# EasyEDA Pro project ProPrj_火车制动系统-信阳_2025-06-22.epro

# Schematic Schematic1

## Sheets
1 P1: Board Name: Board1; Create Date: 2025-05-17; Page Name: P1; Project Name: 火车制动系统-信阳; Schematic Name: Schematic1; Update Date: 2025-05-19; Company: 嘉立创EDA; Page Size: A4; Version: V1.0
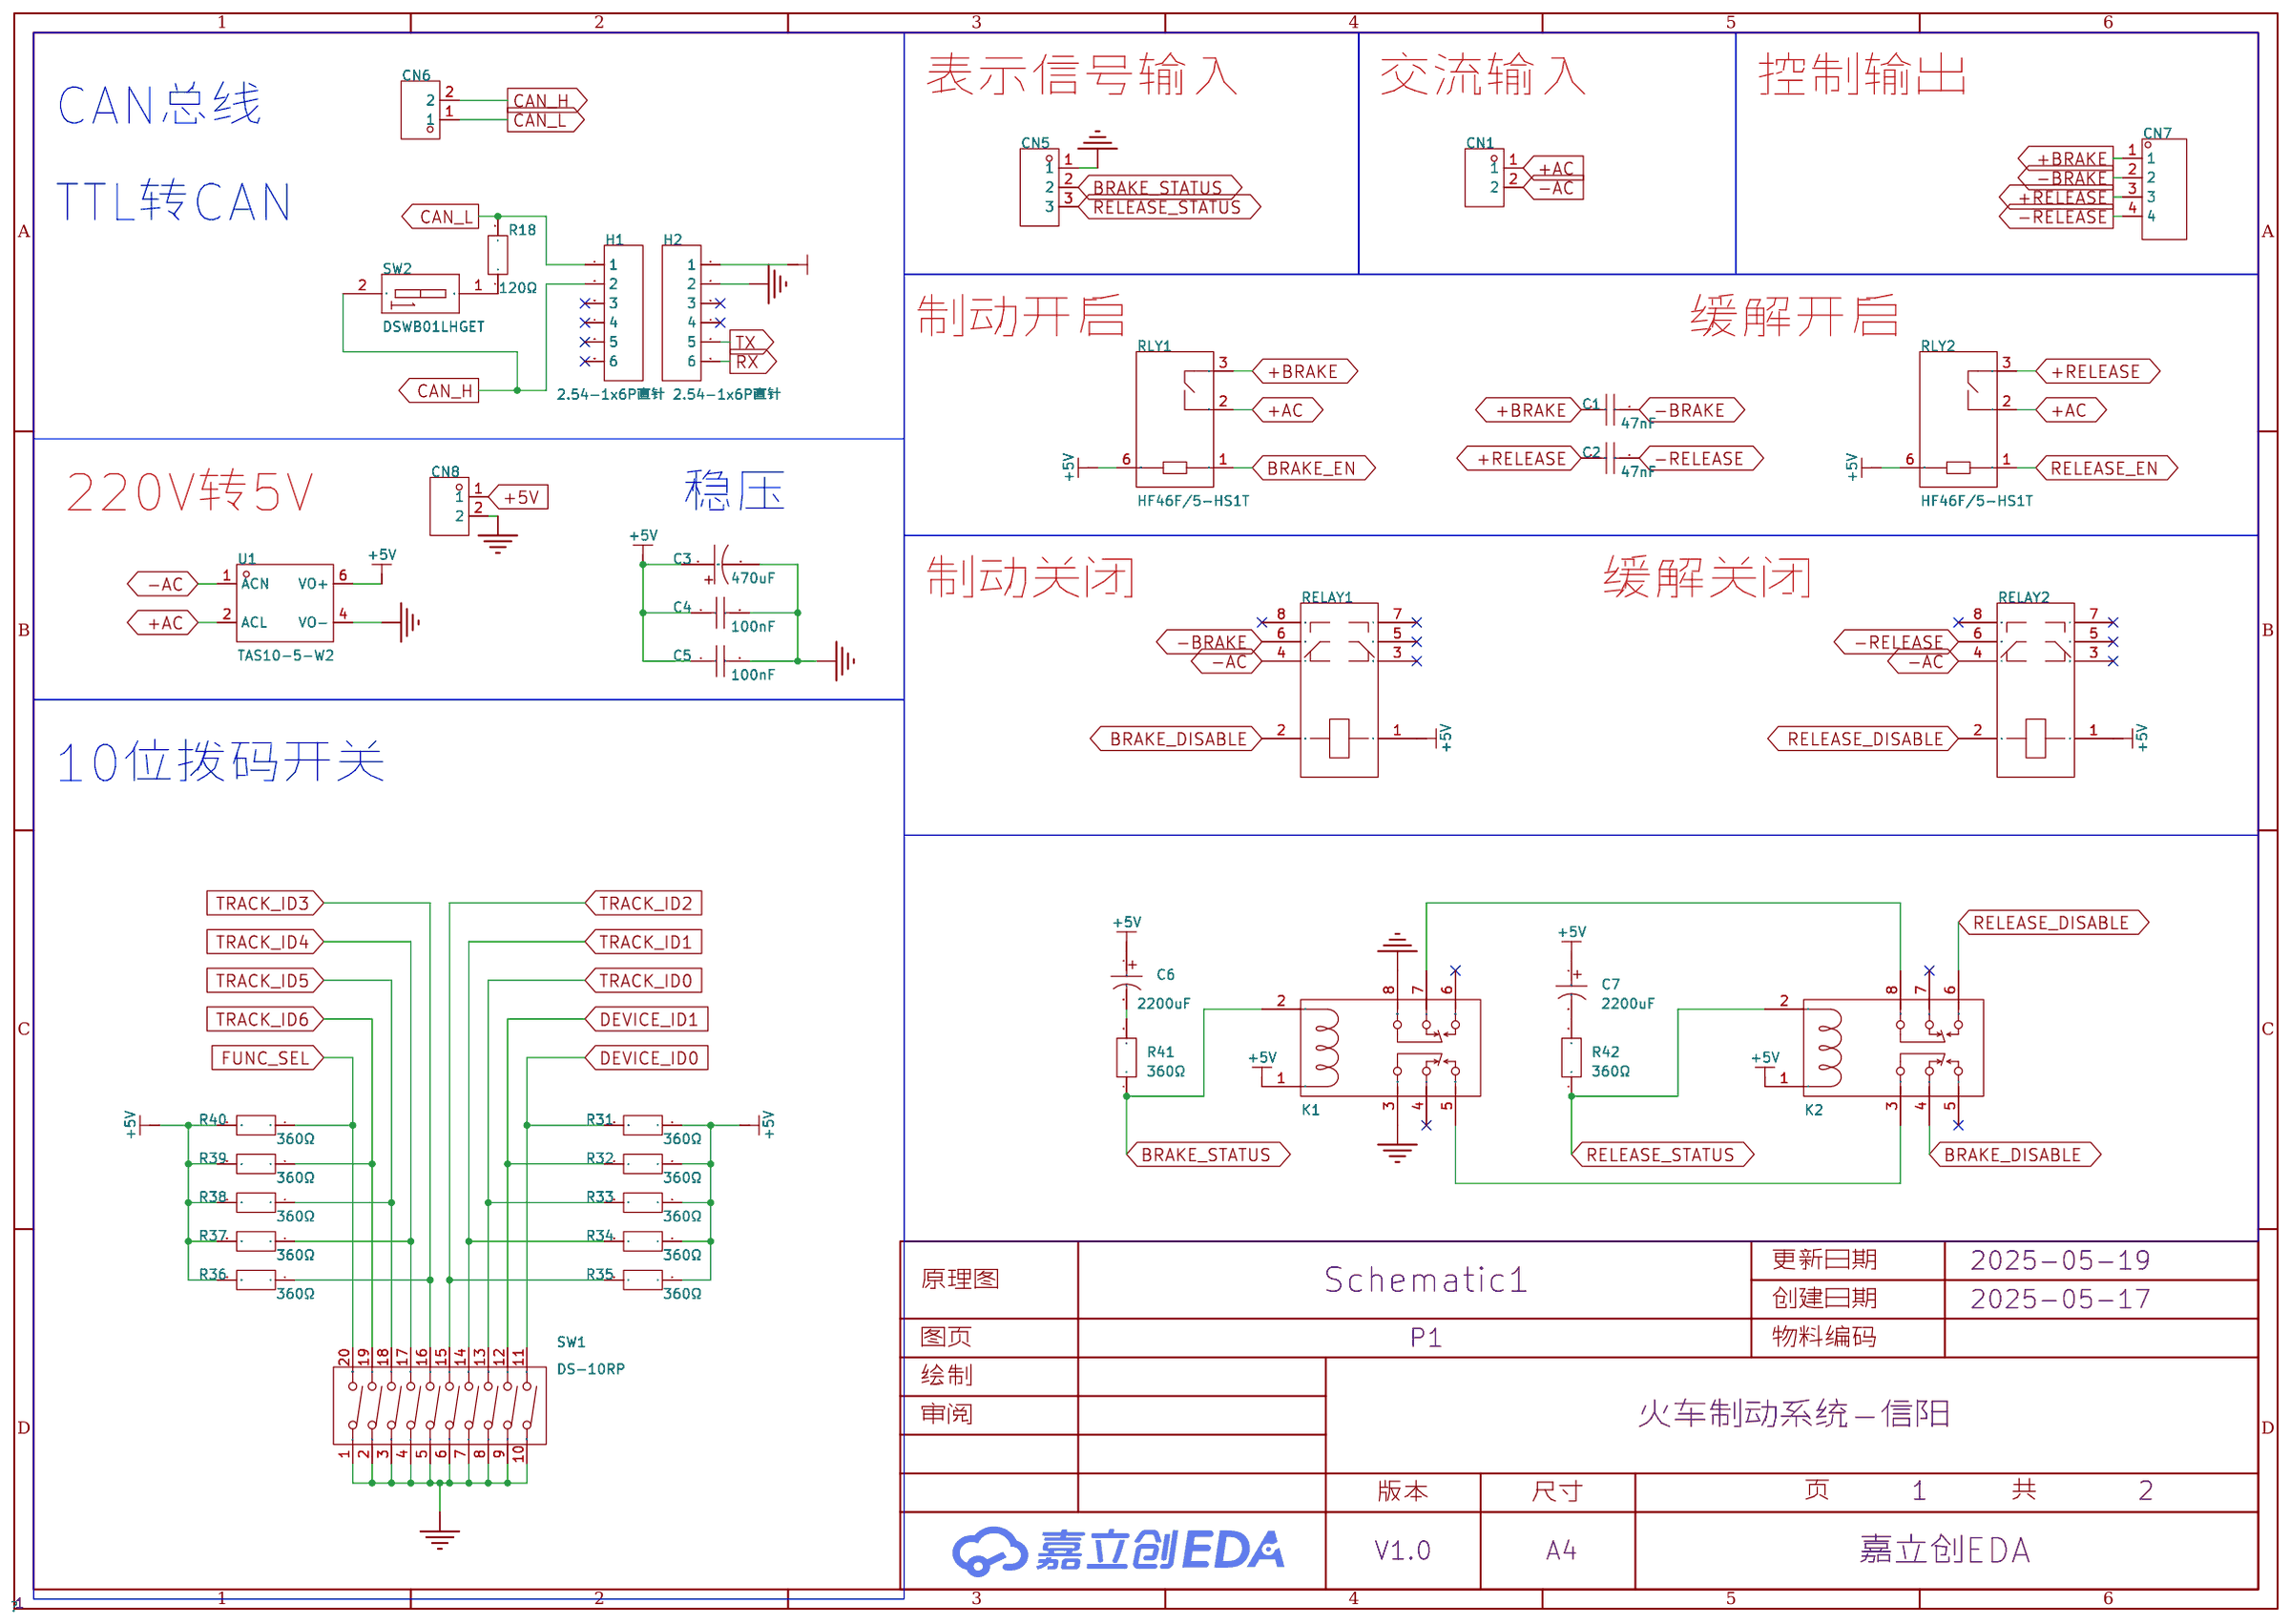
[diagram p0: P1]
2 P2: Page Name: P2; Update Date: 2025-05-27
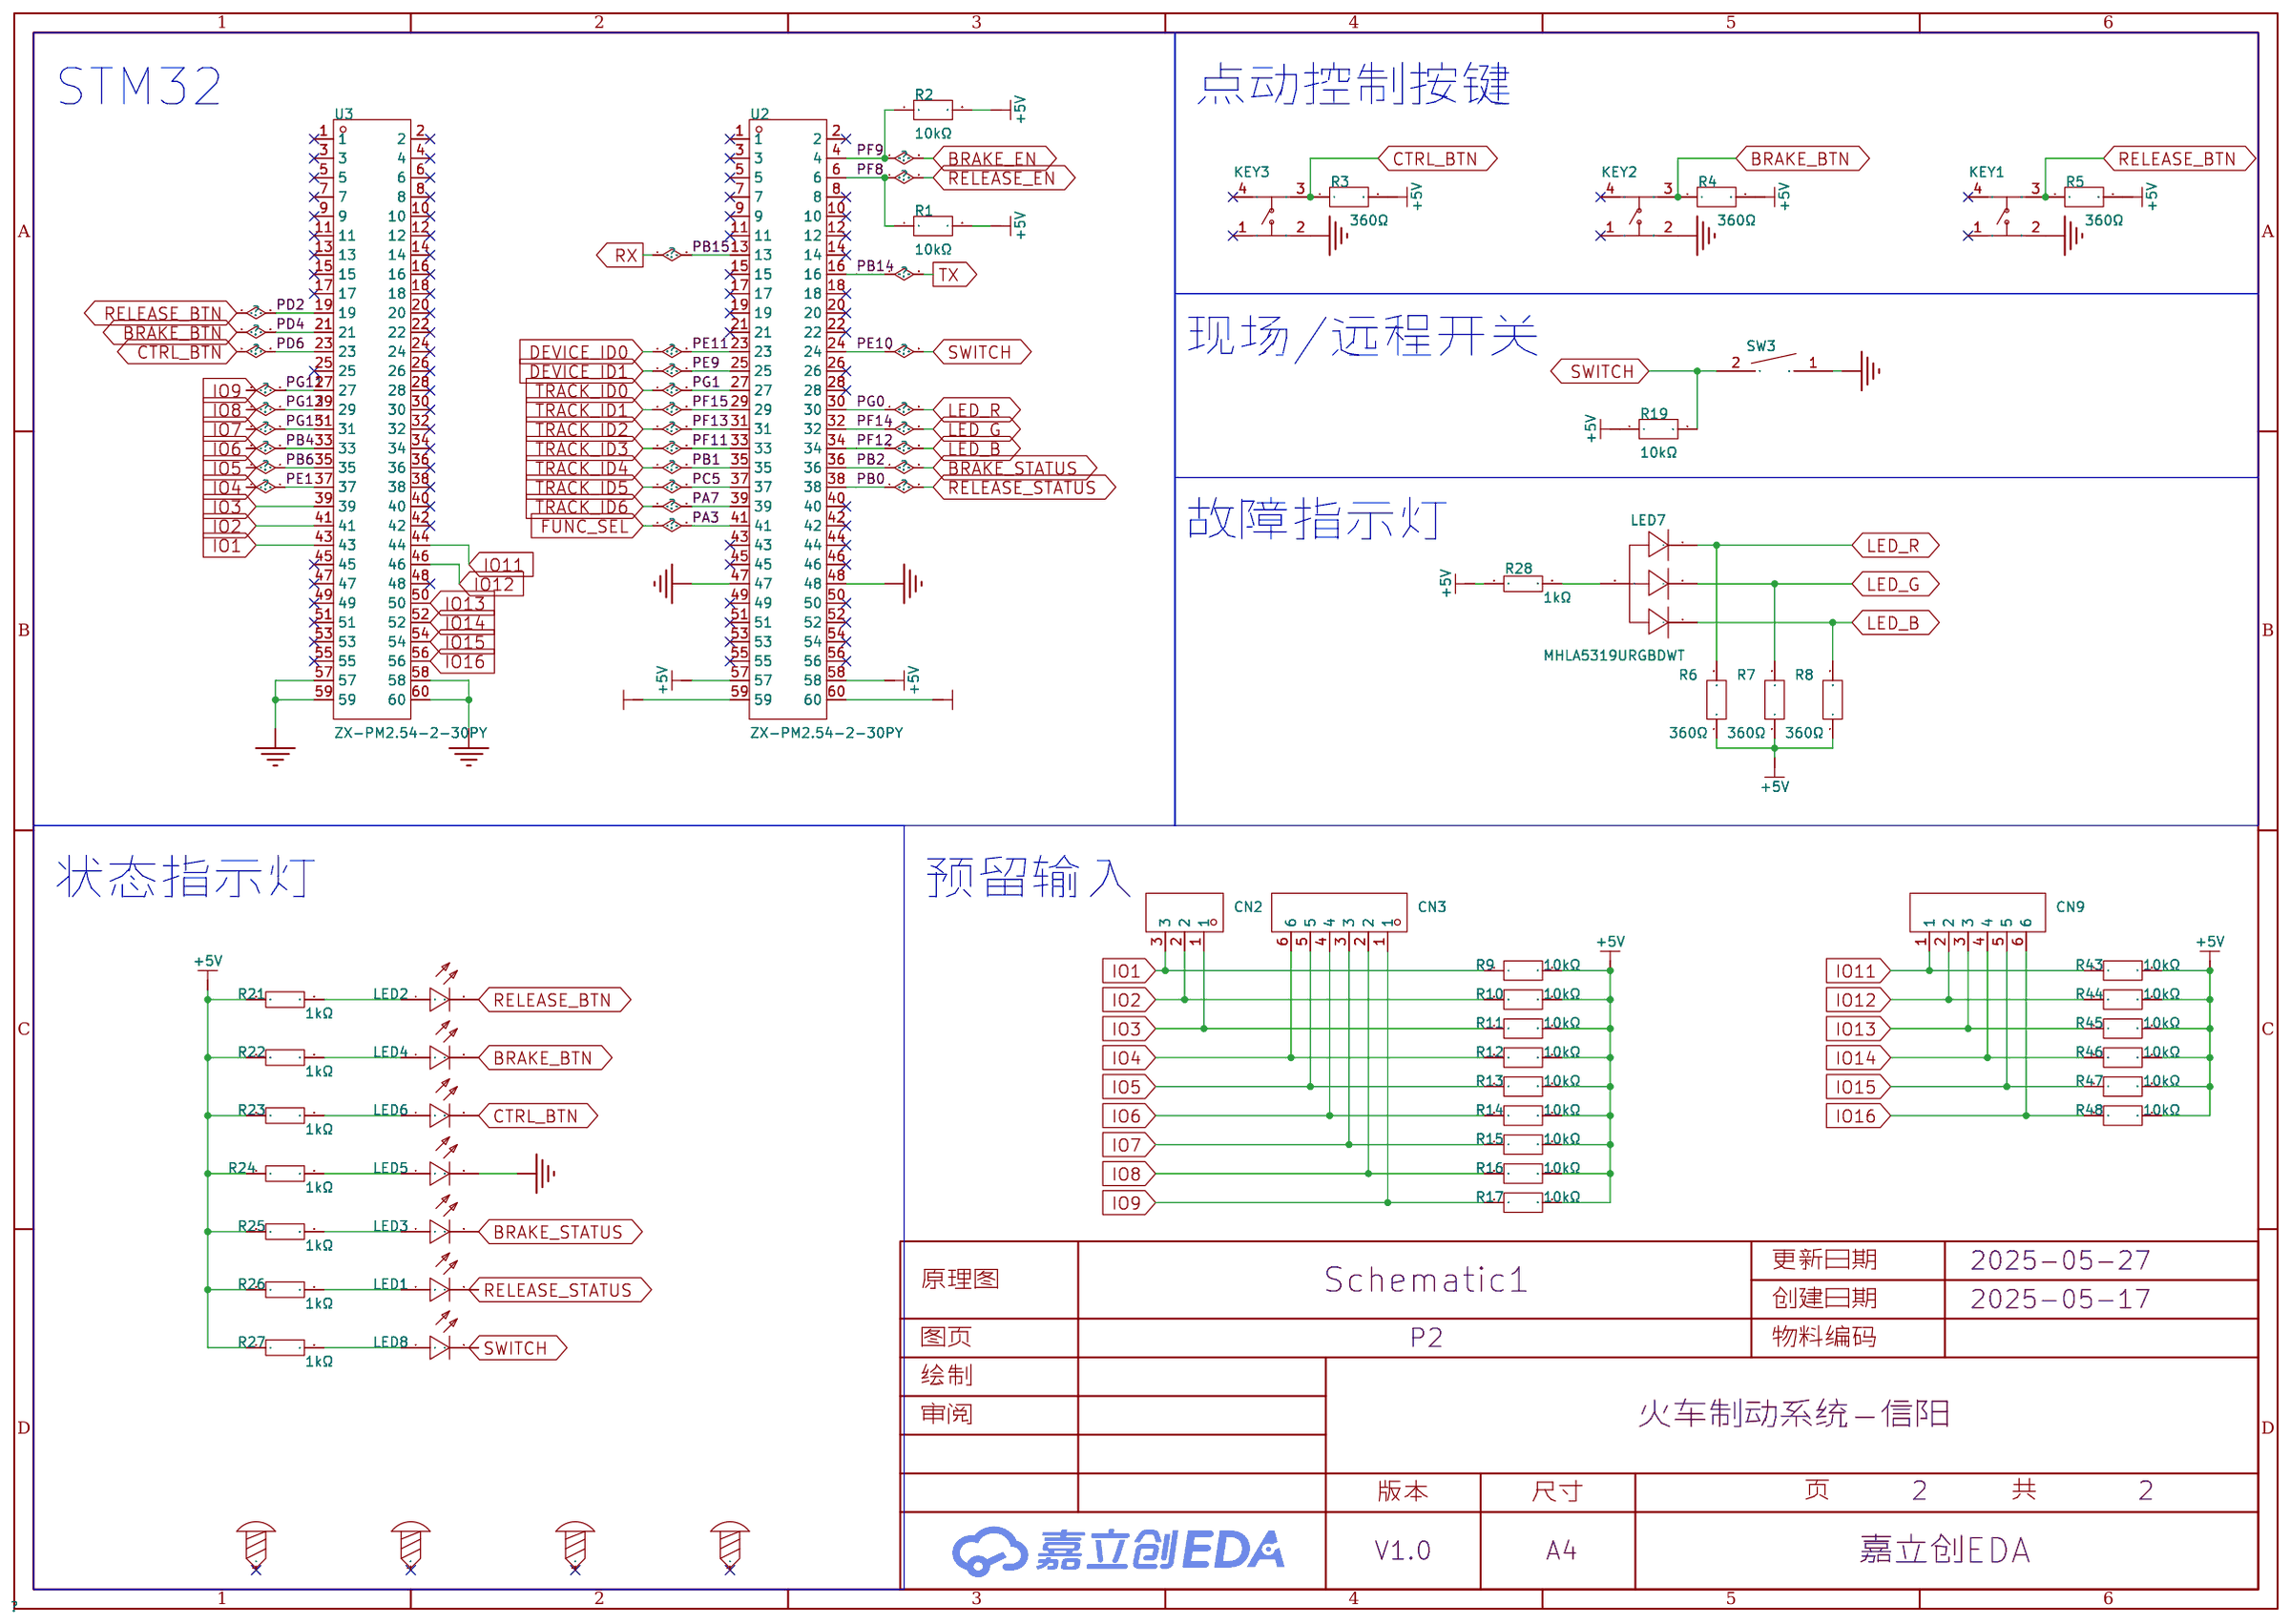
[diagram p1: P2]

## Parts
sheet P1
C1  47nF  [CAP-TH_L18.0-W5.0-P15.00-D0.8]
C2  47nF  [CAP-TH_L18.0-W5.0-P15.00-D0.8]
C3  470uF  [CAP-TH_BD8.0-P3.50-D0.6-FD]
C4  100nF  [C1210]
C5  100nF  [C1210]
C6  2200uF  [CAP-TH_BD10.0-P5.00-D1.0-FD]
C7  2200uF  [CAP-TH_BD10.0-P5.00-D1.0-FD]
CN1  KF2EDGRC-7.62-2P  [CONN-TH_P7.62_KF2EDGRC-7.62-2P]
CN5  KF2EDGRC-7.62-3P  [CONN-TH_3P-P7.62_KF2EDGRC-7.62-3P]
CN6  KF2EDGRC-7.62-2P  [CONN-TH_P7.62_KF2EDGRC-7.62-2P]
CN7  WJ15EDGVC-3.81-4P  [CONN-TH_4P-P3.81_WJ2EDGVC-3.81-4P]
CN8  WJ15EDGVC-3.81-2P  [CONN-TH_WJ15EDGVC-3.81-2P]
H1  2.54-1x6P直针  [HDR-TH_6P-P2.54-V-M-1]
H2  2.54-1x6P直针  [HDR-TH_6P-P2.54-V-M-1]
K1  HRS2H-S-DC5V-N  [RELAY-TH_HRS2H-S-XX]
K2  HRS2H-S-DC5V-N  [RELAY-TH_HRS2H-S-XX]
R18  120Ω  [R1210]
R31  360Ω  [R1210]
R32  360Ω  [R1210]
R33  360Ω  [R1210]
R34  360Ω  [R1210]
R35  360Ω  [R1210]
R36  360Ω  [R1210]
R37  360Ω  [R1210]
R38  360Ω  [R1210]
R39  360Ω  [R1210]
R40  360Ω  [R1210]
R41  360Ω  [R1210]
R42  360Ω  [R1210]
RELAY1  HF115F/005-2ZS4  [RELAY-TH_HF115F-024-2ZS4]
RELAY2  HF115F/005-2ZS4  [RELAY-TH_HF115F-024-2ZS4]
RLY1  HF46F/5-HS1T  [RELAYS-TH_HF46F-XX-HS1-XXX]
RLY2  HF46F/5-HS1T  [RELAYS-TH_HF46F-XX-HS1-XXX]
SW1  DS-10RP  [SW-TH_DS-10RP]
SW2  DSWB01LHGET  [SW-TH_DSWB01LHGET]
U1  TAS10-5-W2  [PWRM-TH_TAS10-XX-W2]
sheet P2
CN2  KF2EDGRC-7.62-3P  [CONN-TH_3P-P7.62_KF2EDGRC-7.62-3P]
CN3  KF2EDGRC-7.62-6P  [CONN-TH_6P-P7.62_KF2EDGRC-7.62-6P]
CN9  DB2EVC-3.81-6P-GN  [CONN-TH_6P-P3.81_DB2EVC-3.81-6P]
KEY1  B3F-4055  [KEY-TH_4P-L12.0-W12.0-P5.00-LS13.4-EH]
KEY2  B3F-4055  [KEY-TH_4P-L12.0-W12.0-P5.00-LS13.4-EH]
KEY3  B3F-4055  [KEY-TH_4P-L12.0-W12.0-P5.00-LS13.4-EH]
LED1  204-10SURD/S530-A3  [LED-TH_BD3.0-P2.54-FD]
LED2  204-10SURD/S530-A3  [LED-TH_BD3.0-P2.54-FD]
LED3  204-10SURD/S530-A3  [LED-TH_BD3.0-P2.54-FD]
LED4  204-10SURD/S530-A3  [LED-TH_BD3.0-P2.54-FD]
LED5  204-10SURD/S530-A3  [LED-TH_BD3.0-P2.54-FD]
LED6  204-10SURD/S530-A3  [LED-TH_BD3.0-P2.54-FD]
LED7  MHLA5319URGBDWT  [LED-TH_4P-BD6.9-P1.27-R]
LED8  204-10SURD/S530-A3  [LED-TH_BD3.0-P2.54-FD]
R1  10kΩ  [R1210]
R2  10kΩ  [R1210]
R3  360Ω  [R1210]
R4  360Ω  [R1210]
R5  360Ω  [R1210]
R6  360Ω  [R1210]
R7  360Ω  [R1210]
R8  360Ω  [R1210]
R9  10kΩ  [R1210]
R10  10kΩ  [R1210]
R11  10kΩ  [R1210]
R12  10kΩ  [R1210]
R13  10kΩ  [R1210]
R14  10kΩ  [R1210]
R15  10kΩ  [R1210]
R16  10kΩ  [R1210]
R17  10kΩ  [R1210]
R19  10kΩ  [R1210]
R21  1kΩ  [R1210]
R22  1kΩ  [R1210]
R23  1kΩ  [R1210]
R24  1kΩ  [R1210]
R25  1kΩ  [R1210]
R26  1kΩ  [R1210]
R27  1kΩ  [R1210]
R28  1kΩ  [R1210]
R43  10kΩ  [R1210]
R44  10kΩ  [R1210]
R45  10kΩ  [R1210]
R46  10kΩ  [R1210]
R47  10kΩ  [R1210]
R48  10kΩ  [R1210]
SCREW1  -  [M4螺丝]
SCREW2  -  [M4螺丝]
SCREW3  -  [M4螺丝]
SCREW4  -  [M4螺丝]
SW3  RS601HL-1010011BB  [SW-TH_RS601HL-1010011BB]
U2  ZX-PM2.54-2-30PY  [HDR-TH_60P-P2.54-V-F-R2-C30-S2.54]
U3  ZX-PM2.54-2-30PY  [HDR-TH_60P-P2.54-V-F-R2-C30-S2.54]

## Library data of the parts
C1 C2 = MEX473K275A01: 容值:47nF;精度:±10%;电压(AC):275V;等级:X2;; LCSC Part Name: 等级:X2 47nF ±10% 275V; Supplier Part: C8970; Manufacturer: TENTA(天泰); Supplier Footprint: 插件,P=15mm; JLCPCB Part Class: 扩展库; Datasheet: https://atta.szlcsc.com/upload/public/pdf/source/20180207/C180193_15179897177401356415.pdf; Supplier: LCSC; Tolerance: ±10%; Voltage(AC): 275V; Subclass: X2
C3 = ERS1CM471F12OT: 容值:470uF;精度:±20%;额定电压:16V;; LCSC Part Name: 470uF ±20% 16V; Supplier Part: C160146; Manufacturer: AISHI(艾华集团); Supplier Footprint: 插件,D8xL12mm; JLCPCB Part Class: 扩展库; Datasheet: https://atta.szlcsc.com/upload/public/pdf/source/20191015/C438940_4B8E60A742BB0AE40DDEF87A5C89089D.pdf; Supplier: LCSC; Tolerance: ±20%; Rated Voltage: 16V; Lead Spacing: 3.5mm; φD: 8mm; L: 12mm; Lifetime @ Temp: 7000hrs@105℃
C4 C5 = 1210B104K500NT: 容值:100nF;精度:±10%;额定电压:50V;材质(温度系数):X7R;; LCSC Part Name: 100nF ±10% 50V; Supplier Part: C76567; Manufacturer: FH(风华); Supplier Footprint: 1210; JLCPCB Part Class: 扩展库; Datasheet: https://atta.szlcsc.com/upload/public/pdf/source/20200305/C486355_26A10D38EF8C2A5C37091D0039909270.pdf; Supplier: LCSC; Tolerance: ±10%; Voltage Rated: 50V; Temperature Coefficient: X7R
C6 C7 = KF222M016G200A: 容值:2200uF;精度:±20%;额定电压:16V;; LCSC Part Name: 2200uF ±20% 16V; Supplier Part: C77730; Manufacturer: CapXon(丰宾); Supplier Footprint: 插件,D10xL20mm; JLCPCB Part Class: 扩展库; Datasheet: https://atta.szlcsc.com/upload/public/pdf/source/20190311/C77730_4071F7D6331134CE149FE96A0814C9E0.pdf; Supplier: LCSC; Tolerance: ±20%; Rated Voltage: 16V; Lead Spacing: 5mm; φD: 10mm; L: 20mm; Lifetime @ Temp: 5000hrs@105℃
CN1 CN6 = KF2EDGRC-7.62-2P: 连接器类型:板端/插座-闭口;结构:1x2P;间距:7.62mm;颜色:绿色;安装方式:弯针;排数:1;每排PIN数:2;额定电流:15A;额定电压:400V;工作温度范围:-40℃~+105℃;; LCSC Part Name: 7.62mm 1x2P 排数:1 每排P数:2; Supplier Part: C441246; Manufacturer: KEFA(科发); Supplier Footprint: 弯插,P=7.62mm; JLCPCB Part Class: 扩展库; Datasheet: https://atta.szlcsc.com/upload/public/pdf/source/20230331/98017C42E55659E793A45F1EF0D85FE6.pdf; Supplier: LCSC; Connector Type: 板端/插座-闭口; Structure: 1x2P; Pitch: 7.62mm; Color: 绿色; Mounting Style: 弯针; Number of Rows: 1; Number of PINs Per Row: 2; Current Rating (Max): 15A; Voltage Rating (Max): 400V; Operating Temperature Range: -40℃~+105℃
CN2 CN5 = KF2EDGRC-7.62-3P: 连接器类型:板端/插座-闭口;结构:1x3P;间距:7.62mm;颜色:绿色;安装方式:弯针;排数:1;每排PIN数:3;额定电流:15A;额定电压:400V;工作温度范围:-40℃~+105℃;; LCSC Part Name: 7.62mm 1x3P 排数:1 每排P数:3; Supplier Part: C441247; Manufacturer: KEFA(科发); Supplier Footprint: 弯插,P=7.62mm; JLCPCB Part Class: Extended Part; Datasheet: https://atta.szlcsc.com/upload/public/pdf/source/20230331/98017C42E55659E793A45F1EF0D85FE6.pdf; Supplier: LCSC; Connector Type: 板端/插座-闭口; Structure: 1x3P; Pitch: 7.62mm; Color: 绿色; Mounting Style: 弯针; Number of Pins: 3P; Number of Rows: 1; Number of PINs Per Row: 3; Current Rating (Max): 15A; Voltage Rating (Max): 400V; Operating Temperature Range: -40℃~+105℃
CN7 = WJ15EDGVC-3.81-4P: 连接器类型:板端/插座-闭口;固定方式:-;结构:1x4P;间距:3.81mm;颜色:-;安装方式:直针;排数:1;每排PIN数:4;额定电流:8A;额定电压:300V;线规 - AWG:-;线规 - 平方毫米:-;触头材质:黄铜;触头镀层:锡;工作温度范围:-40℃~+105℃;焊接温度(最大值):-;; LCSC Part Name: 1x4P 3.81mm 排数:1 每排P数:4; Supplier Part: C8410; Manufacturer: KANGNEX(康奈克斯电气); Supplier Footprint: 插件,P=3.81mm; JLCPCB Part Class: 扩展库; Datasheet: https://atta.szlcsc.com/upload/public/pdf/source/20191225/C8410_C8794F457058DA07325589F32B6A11CC.pdf; Supplier: LCSC; Connector Type: 板端/插座-闭口; Structure: 1x4P; Pitch: 3.81mm; Mounting Style: 直针; Number of Pins: 4P; Number of Rows: 1; Number of PINs Per Row: 4; Current Rating (Max): 8A; Voltage Rating (Max): 300V; Contact Material: 黄铜; Contact Plating: 锡; Operating Temperature Range: -40℃~+105℃
CN8 = WJ15EDGVC-3.81-2P: 连接器类型:板端/插座-闭口;固定方式:-;结构:1x2P;间距:3.81mm;颜色:-;安装方式:直针;排数:1;每排PIN数:2;额定电流:8A;额定电压:300V;线规 - AWG:-;线规 - 平方毫米:-;触头材质:黄铜;触头镀层:锡;工作温度范围:-40℃~+105℃;焊接温度(最大值):-;; LCSC Part Name: 1x2P 3.81mm 排数:1 每排P数:2; Supplier Part: C8396; Manufacturer: KANGNEX(康奈克斯电气); Supplier Footprint: 插件,P=3.81mm; JLCPCB Part Class: Extended Part; Datasheet: https://atta.szlcsc.com/upload/public/pdf/source/20191225/C8396_DFFE6D58C2AF45781C2AF0BF2B733CCC.pdf; Supplier: LCSC; Connector Type: 板端/插座-闭口; Structure: 1x2P; Pitch: 3.81mm; Mounting Style: 直针; Number of Pins: 2P; Number of Rows: 1; Number of PINs Per Row: 2; Current Rating (Max): 8A; Voltage Rating (Max): 300V; Contact Material: 黄铜; Contact Plating: 锡; Operating Temperature Range: -40℃~+105℃
H1 H2 = 2.54-1x6P直针: 插针结构:1x6P;间距:2.54mm;行距:-;圆针/方针:方针;安装方式:直插;排数:单排;总PIN位数:6P;额定电流:3A;额定电压:-;配合针长度:-;塑高:-;触头材质:黄铜;触头镀层:-;工作温度:-40℃~+105℃;颜色:黑色;; LCSC Part Name: 1x6P 间距:2.54mm 方针 直插; Supplier Part: C37208; Manufacturer: BOOMELE(博穆精密); Supplier Footprint: 插件,P=2.54mm; JLCPCB Part Class: Extended Part; Datasheet: https://atta.szlcsc.com/upload/public/pdf/source/20250115/42A019761A40C8B839643401D8CA5A96.pdf; Supplier: LCSC; Pin Structure: 1x6P; Pitch: 2.54mm; Circluar Pins/Square Pins: 方针; Mounting Type: 直插; Number of Rows: 单排; Number of Pins: 6P; Current Rating: 3A; Contact Material: 黄铜; Operating Temperature: -40℃~+105℃; Color: 黑色
K1 K2 = HRS2H-S-DC5V-N: 线圈电压:-;触点形式:-;触点容量(电阻负载):-;最大切换电压:-;最大切换电流:-;; Supplier Part: C13497; Manufacturer: HKE(汇港); Supplier Footprint: DIP,9.9x21mm; JLCPCB Part Class: Extended Part; Datasheet: https://atta.szlcsc.com/upload/public/pdf/source/20161108/1478586357401.pdf; Supplier: LCSC
R18 = FRC1210J121 TS: 电阻类型:厚膜电阻;阻值:120Ω;精度:±5%;功率:500mW;最大工作电压:200V;温度系数:±100ppm/℃;; LCSC Part Name: 厚膜电阻 120Ω ±5% 500mW; Supplier Part: C2933833; Manufacturer: FOJAN(富捷); Supplier Footprint: 1210; JLCPCB Part Class: 扩展库; Datasheet: https://atta.szlcsc.com/upload/public/pdf/source/20211221/925EC7D7225764EE0046F22065062C87.pdf; Supplier: LCSC; Type: 厚膜电阻; Tolerance: ±5%; Power(Watts): 500mW; Overload Voltage (Max): 200V; Temperature Coefficient: ±100ppm/℃; Operating Temperature Range: -55℃~+155℃
R3-R8 R31-R42 = AC1210JR-07360RL: 电阻类型:厚膜电阻;阻值:360Ω;精度:±5%;功率:500mW;最大工作电压:200V;温度系数:±100ppm/℃;; LCSC Part Name: 厚膜电阻 360Ω ±5% 500mW; Supplier Part: C230448; Manufacturer: YAGEO(国巨); Supplier Footprint: 1210; JLCPCB Part Class: 扩展库; Datasheet: https://atta.szlcsc.com/upload/public/pdf/source/20191108/C230504_7FB43CAE7E86B3B2980C2491161B254C.pdf; Supplier: LCSC; Type: 厚膜电阻; Tolerance: ±5%; Power(Watts): 500mW; Overload Voltage (Max): 200V; Temperature Coefficient: ±100ppm/℃; Operating Temperature Range: -55℃~+155℃
RELAY1 RELAY2 = HF115F/005-2ZS4: 线圈电压:5V;触点形式:两组转换:2C(双刀双掷-转换);触点容量(电阻负载):8A@250VAC;最大切换电压:440V@AC；300V@DC;最大切换电流:8A;; Supplier Part: C9226; Manufacturer: HF(宏发); Supplier Footprint: DIP,12.7x29mm; JLCPCB Part Class: 扩展库; Datasheet: https://atta.szlcsc.com/upload/public/pdf/source/20180326/C9226_00E5F9D0110139C053E72FC6A3214472.pdf; Supplier: LCSC; Coil Voltage: 5V; Contact Form: 两组转换:2C(双刀双掷-转换); Pin Number: 8; Contact Rating: 8A@250VAC; Maximum Switching Voltage: 440V@AC；300V@DC; Coil Rated Power: 400mW; Contact Material: AgCdO; Maximum Switching Current: 8A; Coil Type: 无极性-单线圈; Coil Resistance: 62Ω; Contact Resistance: 100mΩ; Operate Time: 15ms; Release Time: 8ms; Operating Temperature: -40℃~+85℃
RLY1 RLY2 = HF46F/5-HS1T_C3036134: 线圈电压:5V;触点形式:一组常开:1A(单刀单掷-常开);触点容量(电阻负载):5A@30VDC；5A@250VAC;最大切换电压:277V@AC；30V@DC;最大切换电流:5A;; LCSC Part Name: 超小型中功率5V继电器 单刀单掷-常开; Supplier Part: C3036134; Manufacturer: HF(宏发); Supplier Footprint: 插件,7x20.5mm; JLCPCB Part Class: Extended Part; Datasheet: https://atta.szlcsc.com/upload/public/pdf/source/20180301/C182930_15198945723621384141.pdf; Supplier: LCSC; Coil Voltage: 5V; Contact Form: 一组常开:1A(单刀单掷-常开); Pin Number: 4; Contact Rating: 5A@30VDC；5A@250VAC; Maximum Switching Voltage: 277V@AC；30V@DC; Coil Rated Power: 200mW; Contact Material: AgSnO2; Maximum Switching Current: 5A; Coil Type: 无极性-单线圈; Coil Resistance: 125Ω; Contact Resistance: 100mΩ; Operate Time: 10ms; Release Time: 10ms; Operating Temperature: -40℃~+85℃
SW1 = DS-10RP: 类型:平拨,凸起式;电路结构:单刀单掷;开关位数:10位;额定电流:25mA;额定电压:24V;使用寿命:3千次;颜色:红色;; LCSC Part Name: 间距2.54mm 平拨,凸起式 10位拨码开关; Supplier Part: C458082; Manufacturer: 韩国韩荣; Supplier Footprint: 插件; JLCPCB Part Class: 扩展库; Datasheet: https://atta.szlcsc.com/upload/public/pdf/source/20210810/ECF2F28B1CE673E7F9581E27682BDB10.pdf; Supplier: LCSC; Type: 平拨,凸起式; Circuit: 单刀单掷; Number of Positions: 10位; Lead Pitch: 2.54mm; Current Rating: 25mA; Voltage Rating: 24V; Operating Temperature: -20℃~+70℃; Operating Life: 3千次; Color: 红色
SW2 = DSWB01LHGET: 类型:平拨,凸起式;电路结构:单刀单掷;开关位数:1位;使用寿命:-;颜色:红色;; LCSC Part Name: 红色宽体1位顶拨插件; Supplier Part: C126888; Manufacturer: YE; Supplier Footprint: 插件,9.9x4mm; JLCPCB Part Class: 扩展库; Datasheet: https://atta.szlcsc.com/upload/public/pdf/source/20240423/2AB41BE17D24959C6789B2A71E54D492.pdf; Supplier: LCSC; Type: 平拨,凸起式; Circuit: 单刀单掷; Number of Positions: 1位; Color: 红色
U1 = TAS10-5-W2: 输出5V,峰值10W,精度1%,耐压大于2.5KVAC,工业级,该系列效率高达85%,待机功耗低至0.15W,输出纹波外加铝电容小于50mV，标准尺寸多厂家管脚兼容，DIP:38*19*18; Supplier Part: C2687655; Manufacturer: TDPOWER(腾达电源); Supplier Footprint: 插件,25x39mm; JLCPCB Part Class: Extended Part; Datasheet: https://atta.szlcsc.com/upload/public/pdf/source/20210914/95F169B7B21081D929A6CFE8A15609A6.pdf; Supplier: LCSC
CN3 = KF2EDGRC-7.62-6P: 连接器类型:板端/插座-闭口;结构:1x6P;间距:7.62mm;颜色:绿色;安装方式:弯针;排数:1;每排PIN数:6;额定电流:15A;额定电压:400V;工作温度范围:-40℃~+105℃;; LCSC Part Name: 7.62mm 1x6P 排数:1 每排P数:6; Supplier Part: C441250; Manufacturer: KEFA(科发); Supplier Footprint: 弯插,P=7.62mm; JLCPCB Part Class: 扩展库; Datasheet: https://atta.szlcsc.com/upload/public/pdf/source/20230331/98017C42E55659E793A45F1EF0D85FE6.pdf; Supplier: LCSC; Connector Type: 板端/插座-闭口; Structure: 1x6P; Pitch: 7.62mm; Color: 绿色; Mounting Style: 弯针; Number of Pins: 6P; Number of Rows: 1; Number of PINs Per Row: 6; Current Rating (Max): 15A; Voltage Rating (Max): 400V; Operating Temperature Range: -40℃~+105℃
CN9 = DB2EVC-3.81-6P-GN: 连接器类型:板端/插座-闭口;结构:1x6P;间距:3.81mm;颜色:绿色;安装方式:直针;排数:1;每排PIN数:6;额定电流:10A;额定电压:250V;工作温度范围:-40℃~+105℃;; LCSC Part Name: 3.81mm 1x6P 排数:1 每排P数:6; Supplier Part: C395707; Manufacturer: DORABO(地博电气); Supplier Footprint: 插件,P=3.81mm; JLCPCB Part Class: 扩展库; Datasheet: https://atta.szlcsc.com/upload/public/pdf/source/20230106/E295F87ABDAA44E449E4D4A582259339.pdf; Supplier: LCSC; Connector Type: 板端/插座-闭口; Structure: 1x6P; Pitch: 3.81mm; Color: 绿色; Mounting Style: 直针; Number of Pins: 6P; Number of Rows: 1; Number of PINs Per Row: 6; Current Rating (Max): 10A; Voltage Rating (Max): 250V; Operating Temperature Range: -40℃~+105℃
KEY1-KEY3 = B3F-4055_C84931: 电路结构:单刀单掷;按钮形状:矩形按钮;安装方式:直插;开关长度:12mm;开关宽度:12mm;开关高度:7.3mm;触点电流:50mA;额定电压(DC):24V;带灯:-;机械寿命:-;; LCSC Part Name: 12*12*7.3mm 直插 轻触开关; Supplier Part: C84931; Manufacturer: OMRON(欧姆龙); Supplier Footprint: 插件; JLCPCB Part Class: 扩展库; Datasheet: https://atta.szlcsc.com/upload/public/pdf/source/20170810/C93157_1502335414592880008.pdf; Supplier: LCSC; Circuit: 单刀单掷; Actuator Style: 矩形按钮; Mounting Style: 直插; Switch Length: 12mm; Switch Width: 12mm; Switch Height: 7.3mm; Contact Current: 50mA; Voltage Rating (DC): 24V
LED1-LED6 LED8 = 204-10SURD/S530-A3: 灯头类型:3mm圆形灯头;发光颜色:红色;正向电压(VF):2V;功率:60mW;正向电流:20mA;主波长:624nm;二极管配置:-;透镜颜色:雾状红透镜;色温:-;发光强度:80mcd;发光角度:45°;载带方式:-;工作温度:-40℃~+85℃;; Supplier Part: C99772; Manufacturer: EVERLIGHT(亿光); Supplier Footprint: 插件,D=3mm; JLCPCB Part Class: Extended Part; Datasheet: https://atta.szlcsc.com/upload/public/pdf/source/20170504/1493866937400.pdf; Supplier: LCSC; Lamp Holder Type: 3mm圆形灯头; Emitted Color: 红色; Forward Voltage (VF): 2V; Power Dissipation: 60mW; Forward Current: 20mA; Dominant Wavelength: 624nm; Peak Wavelength: 632nm; Lens Color: 雾状红透镜; Luminous Intensity: 80mcd; Viewing Angle: 45°; Operating Temperature: -40℃~+85℃
LED7 = MHLA5319URGBDWT: LCSC Part Name: RGB三色; Supplier Part: C417349; Manufacturer: MEIHUA(美华); Supplier Footprint: 插件,D=5mm; JLCPCB Part Class: 扩展库; Datasheet: https://atta.szlcsc.com/upload/public/pdf/source/20190909/C417349_5EE64C2B845439F4B2C4E6D0A2E388FC.pdf; Supplier: LCSC
R1 R2 R9-R17 R19 R43-R48 = 1210W2J0103T5E: 电阻类型:厚膜电阻;阻值:10kΩ;精度:±5%;功率:500mW;最大工作电压:200V;温度系数:±100ppm/℃;; LCSC Part Name: 10kΩ ±5% 500mW 厚膜电阻; Supplier Part: C474295; Manufacturer: UNI-ROYAL(厚声); Supplier Footprint: 1210; JLCPCB Part Class: 扩展库; Datasheet: https://atta.szlcsc.com/upload/public/pdf/source/20200306/C422600_1E6D84923E4A46A82E41ADD87F860B5C.pdf; Supplier: LCSC; Type: 厚膜电阻; Tolerance: ±5%; Power(Watts): 500mW; Overload Voltage (Max): 200V; Temperature Coefficient: ±100ppm/℃; Operating Temperature Range: -55℃~+155℃
R21-R28 = 1210W2J0102T5E: 电阻类型:厚膜电阻;阻值:1kΩ;精度:±5%;功率:500mW;最大工作电压:200V;温度系数:±100ppm/℃;; LCSC Part Name: 1kΩ ±5% 500mW 厚膜电阻; Supplier Part: C270888; Manufacturer: UNI-ROYAL(厚声); Supplier Footprint: 1210; JLCPCB Part Class: 扩展库; Datasheet: https://atta.szlcsc.com/upload/public/pdf/source/20200306/C422600_1E6D84923E4A46A82E41ADD87F860B5C.pdf; Supplier: LCSC; Type: 厚膜电阻; Tolerance: ±5%; Power(Watts): 500mW; Overload Voltage (Max): 200V; Temperature Coefficient: ±100ppm/℃; Operating Temperature Range: -55℃~+155℃
SCREW1-SCREW4 = M4螺丝: Supplier Footprint: 插件
SW3 = RS601HL-1010011BB: 带灯:无;引脚样式:焊片;额定电流:3A;额定电压(AC):250V;额定电压(DC):-;电路结构:单刀单掷;机械寿命:1万次;; Supplier Part: C2885782; Manufacturer: HCTL(华灿天禄); Supplier Footprint: 插件; JLCPCB Part Class: 扩展库; Datasheet: https://atta.szlcsc.com/upload/public/pdf/source/20210820/B1970E40D09304D7FA648AE2099FB3E8.pdf; Supplier: LCSC; Switch Length: 15mm; Switch Width: 10.5mm; Switch Height: 11.7mm; Actuator Type: 凹面弯曲; With Lamp: 无; Pin Style: 焊片; Actuator Color: 黑色; Contact Current: 3A; Voltage Rating (AC): 250V; Circuit: 单刀单掷; Mechanical Life: 1万次; Operating Temperature: -25℃~+85℃; Actuator Identifier: - O
U2 = ZX-PM2.54-2-30PY: 插孔结构:2x30P;间距:2.54mm;行距:2.54mm;圆孔/方孔:方孔;安装类型:直插;排数:双排;总孔位数:60P;额定电流:-;额定电压:1kV;插孔方向:顶部;塑高:8.5mm;触头材质:-;触头镀层:金;工作温度范围:-40℃~+105℃;焊接温度(最大值):260℃@5S;; LCSC Part Name: 2x30P 间距:2.54mm 直插; Supplier Part: C7499356; Manufacturer: Megastar(兆星); Supplier Footprint: 插件,P=2.54mm; JLCPCB Part Class: 扩展库; Datasheet: https://atta.szlcsc.com/upload/public/pdf/source/20231122/23E1107B34356833C267F6B6E856DE02.pdf; Supplier: LCSC; Holes Structure: 2x30P; Pitch: 2.54mm; Row Spacing: 2.54mm; Circular Hole / Square Hole: 方孔; Mounting Type: 直插; Number of Rows: 双排; Number of Holes: 60P; Voltage Rating (Max): 1kV; Holes Direction: 顶部; Insulation Height: 8.5mm; Contact Plating: 金; Operating Temperature Range: -40℃~+105℃; Soldering Temperature(Max): 260℃@5S
U3 = ZX-PM2.54-2-30PY: 插孔结构:2x30P;间距:2.54mm;行距:2.54mm;圆孔/方孔:方孔;安装类型:直插;排数:双排;总孔位数:60P;额定电流:-;额定电压:1kV;插孔方向:顶部;塑高:8.5mm;触头材质:-;触头镀层:金;工作温度范围:-40℃~+105℃;焊接温度(最大值):260℃@5S;; LCSC Part Name: 2x30P 间距:2.54mm 直插; Supplier Part: C7499356; Manufacturer: Megastar(兆星); Supplier Footprint: 插件,P=2.54mm; JLCPCB Part Class: Extended Part; Datasheet: https://atta.szlcsc.com/upload/public/pdf/source/20231122/23E1107B34356833C267F6B6E856DE02.pdf; Supplier: LCSC; Holes Structure: 2x30P; Pitch: 2.54mm; Row Spacing: 2.54mm; Circular Hole / Square Hole: 方孔; Mounting Type: 直插; Number of Rows: 双排; Number of Holes: 60P; Voltage Rating (Max): 1kV; Holes Direction: 顶部; Insulation Height: 8.5mm; Contact Plating: 金; Operating Temperature Range: -40℃~+105℃; Soldering Temperature(Max): 260℃@5S

## Nets
+3V3: H2.1 U2.59 U2.60
+5V: C3.1 C4.1 C5.1 C6.1 C7.1 CN8.1 K1.1 K2.1 R1.2 R2.2 R3.2 R4.2 R5.2 R6.1 R7.1 R8.1 R9.2 R10.2 R11.2 R12.2 R13.2 R14.2 R15.2 R16.2 R17.2 R19.1 R21.1 R22.1 R23.1 R24.1 R25.1 R26.1 R27.1 R28.1 R31.1 R32.1 R33.1 R34.1 R35.1 R36.2 R37.2 R38.2 R39.2 R40.2 R43.2 R44.2 R45.2 R46.2 R47.2 R48.2 RELAY1.1 RELAY2.1 RLY1.6 RLY2.6 U1.6(VO+) U2.57 U2.58
GND: C3.2 C4.2 C5.2 CN5.1 CN8.2 H2.2 K1.3 K1.8 KEY1.2 KEY2.2 KEY3.2 LED5.2(K) SW1.1 SW1.2 SW1.3 SW1.4 SW1.5 SW1.6 SW1.7 SW1.8 SW1.9 SW1.10 SW3.1 U1.4(VO-) U2.47 U2.48 U3.57 U3.58 U3.59 U3.60
+AC: CN1.1 RLY1.2 RLY2.2 U1.2(ACL)
+BRAKE: C1.1 CN7.1 RLY1.3
+RELEASE: C2.1 CN7.3 RLY2.3
-AC: CN1.2 RELAY1.4 RELAY2.4 U1.1(ACN)
-BRAKE: C1.2 CN7.2 RELAY1.6
-RELEASE: C2.2 CN7.4 RELAY2.6
BRAKE_BTN: KEY2.3 LED4.2(K) R4.1 U3.21
BRAKE_DISABLE: K2.4 RELAY1.2
BRAKE_EN: R2.1 RLY1.1 U2.4
BRAKE_STATUS: CN5.2 K1.2 LED3.2(K) R41.1 U2.36
CAN_H: CN6.2 H1.2 SW2.2
CAN_L: CN6.1 H1.1 R18.2
CTRL_BTN: KEY3.3 LED6.2(K) R3.1 U3.23
DEVICE_ID0: R31.2 SW1.11 U2.23
DEVICE_ID1: R32.2 SW1.12 U2.25
FUNC_SEL: R40.1 SW1.20 U2.41
IO1: CN2.3 R9.1 U3.43
IO2: CN2.2 R10.1 U3.41
IO3: CN2.1 R11.1 U3.39
IO4: CN3.6 R12.1 U3.37
IO5: CN3.5 R13.1 U3.35
IO6: CN3.4 R14.1 U3.33
IO7: CN3.3 R15.1 U3.31
IO8: CN3.2 R16.1 U3.29
IO9: CN3.1 R17.1 U3.27
IO11: CN9.1 R43.1 U3.44
IO12: CN9.2 R44.1 U3.46
IO13: CN9.3 R45.1 U3.50
IO14: CN9.4 R46.1 U3.52
IO15: CN9.5 R47.1 U3.54
IO16: CN9.6 R48.1 U3.56
LED_B: LED7.4(-) R8.2 U2.34
LED_G: LED7.3(-) R7.2 U2.32
LED_R: LED7.1(-) R6.2 U2.30
PA7: R39.1 SW1.19 U2.39
PB0: CN5.3 K2.2 LED1.2(K) R42.1 U2.38
PB1: R37.1 SW1.17 U2.35
PB14: H2.5 U2.16
PB15: H2.6 U2.13
PC5: R38.1 SW1.18 U2.37
PD2: KEY1.3 LED2.2(K) R5.1 U3.19
PE10: LED8.2(K) R19.2 SW3.2 U2.24
PF8: R1.1 RLY2.1 U2.6
PF11: R36.1 SW1.16 U2.33
PF13: R35.2 SW1.15 U2.31
PF15: R34.2 SW1.14 U2.29
PG1: R33.2 SW1.13 U2.27
RELEASE_DISABLE: K2.6 RELAY2.2
$1N6666: K1.5 K2.3
$1N6674: K1.7 K2.8
$1N37726: C6.2 R41.2
$1N37765: C7.2 R42.2
$1N49921: R18.1 SW2.1(A1)
$2N2785: LED2.1(A) R21.2
$2N2786: LED4.1(A) R22.2
$2N2787: LED6.1(A) R23.2
$2N2791: LED3.1(A) R25.2
$2N2794: LED1.1(A) R26.2
$2N2795: LED5.1(A) R24.2
$2N4277: LED8.1(A) R27.2
$2N10665: LED7.2(+) R28.2

Not connected (* = marked no-connect by the designer): H1 3* 4* 5* 6*; H2 3* 4*; K1 4* 6*; K2 5* 7*; KEY1 1* 4*; KEY2 1* 4*; KEY3 1* 4*; RELAY1 3* 5* 7* 8*; RELAY2 3* 5* 7* 8*; SCREW1 1*; SCREW2 1*; SCREW3 1*; SCREW4 1*; U2 1* 2* 3* 5* 7* 8* 9* 10* 11* 12* 14* 15* 17* 18* 19* 20* 21* 22* 26* 28* 40* 42* 43* 44* 45* 46* 49* 50* 51* 52* 53* 54* 55* 56*; U3 1* 2* 3* 4* 5* 6* 7* 8* 9* 10* 11* 12* 13* 14* 15* 16* 17* 18* 20* 22* 24* 25* 26* 28* 30* 32* 34* 36* 38* 40* 42* 45* 47* 48* 49* 51* 53* 55*

## Notes on the sheets
sheet 1
- 表示信号输入
- 交流输入
- 控制输出
- CAN总线
- TTL转CAN
- 制动开启
- 缓解开启
- 220V转5V
- 稳压
- 制动关闭
- 缓解关闭
- 10位拨码开关
sheet 2
- STM32
- 点动控制按键
- 现场/远程开关
- 故障指示灯
- 状态指示灯
- 预留输入

# Board PCB1
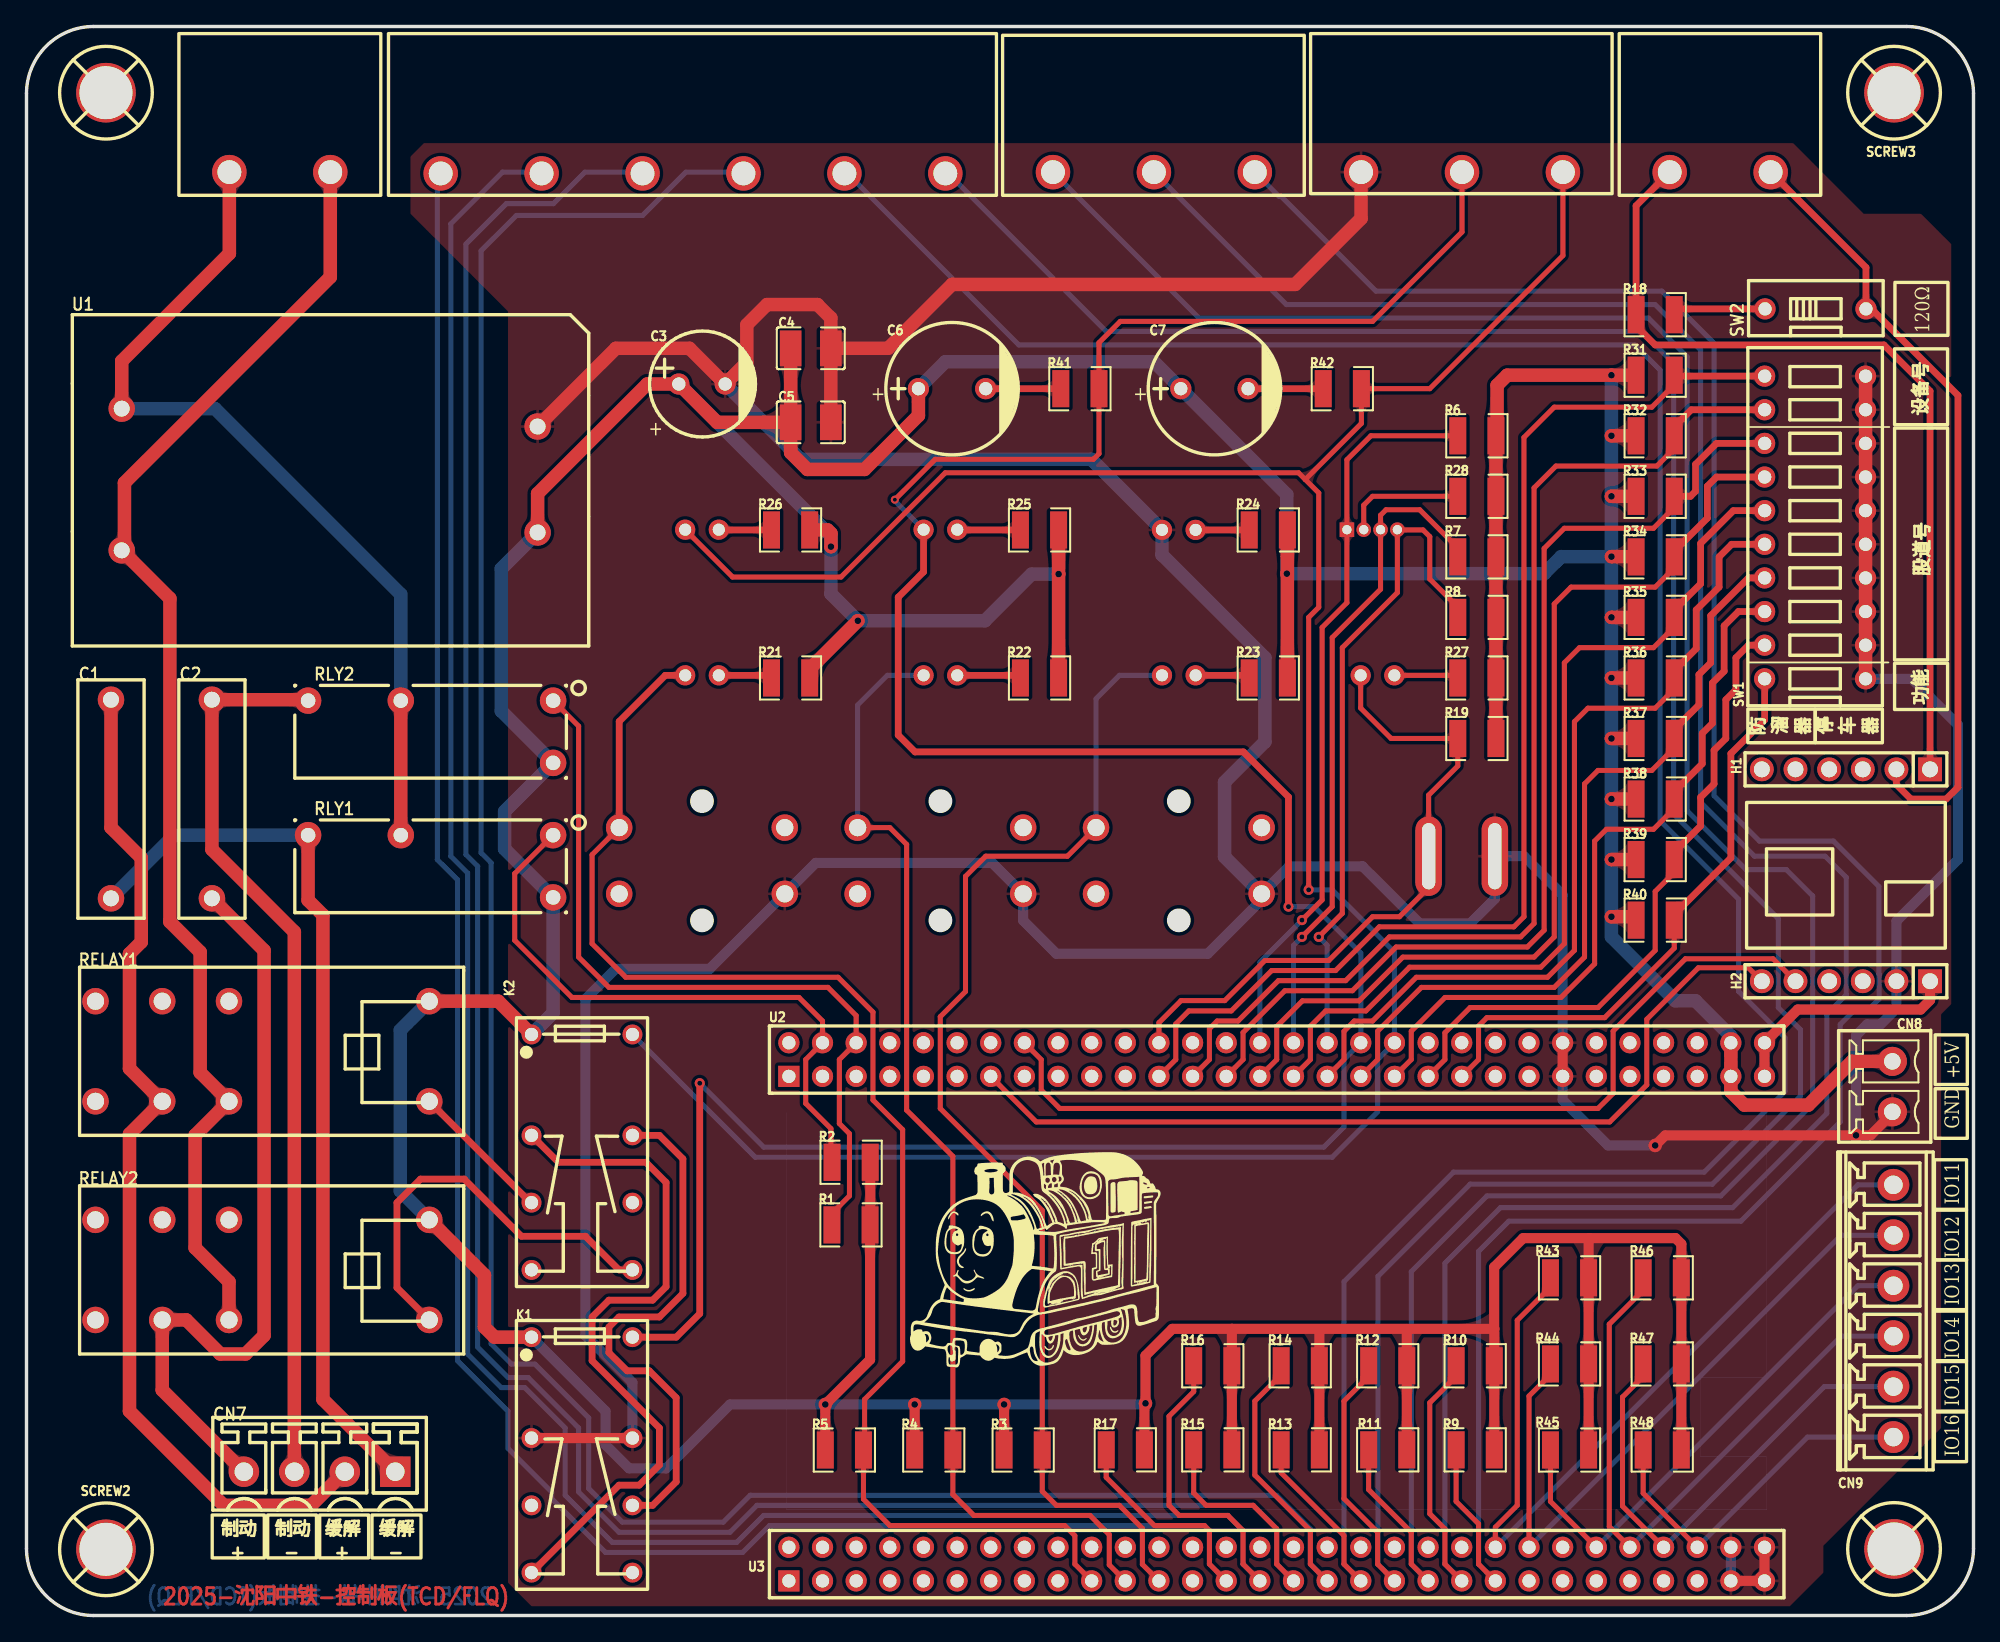
[diagram p2: board, top side]
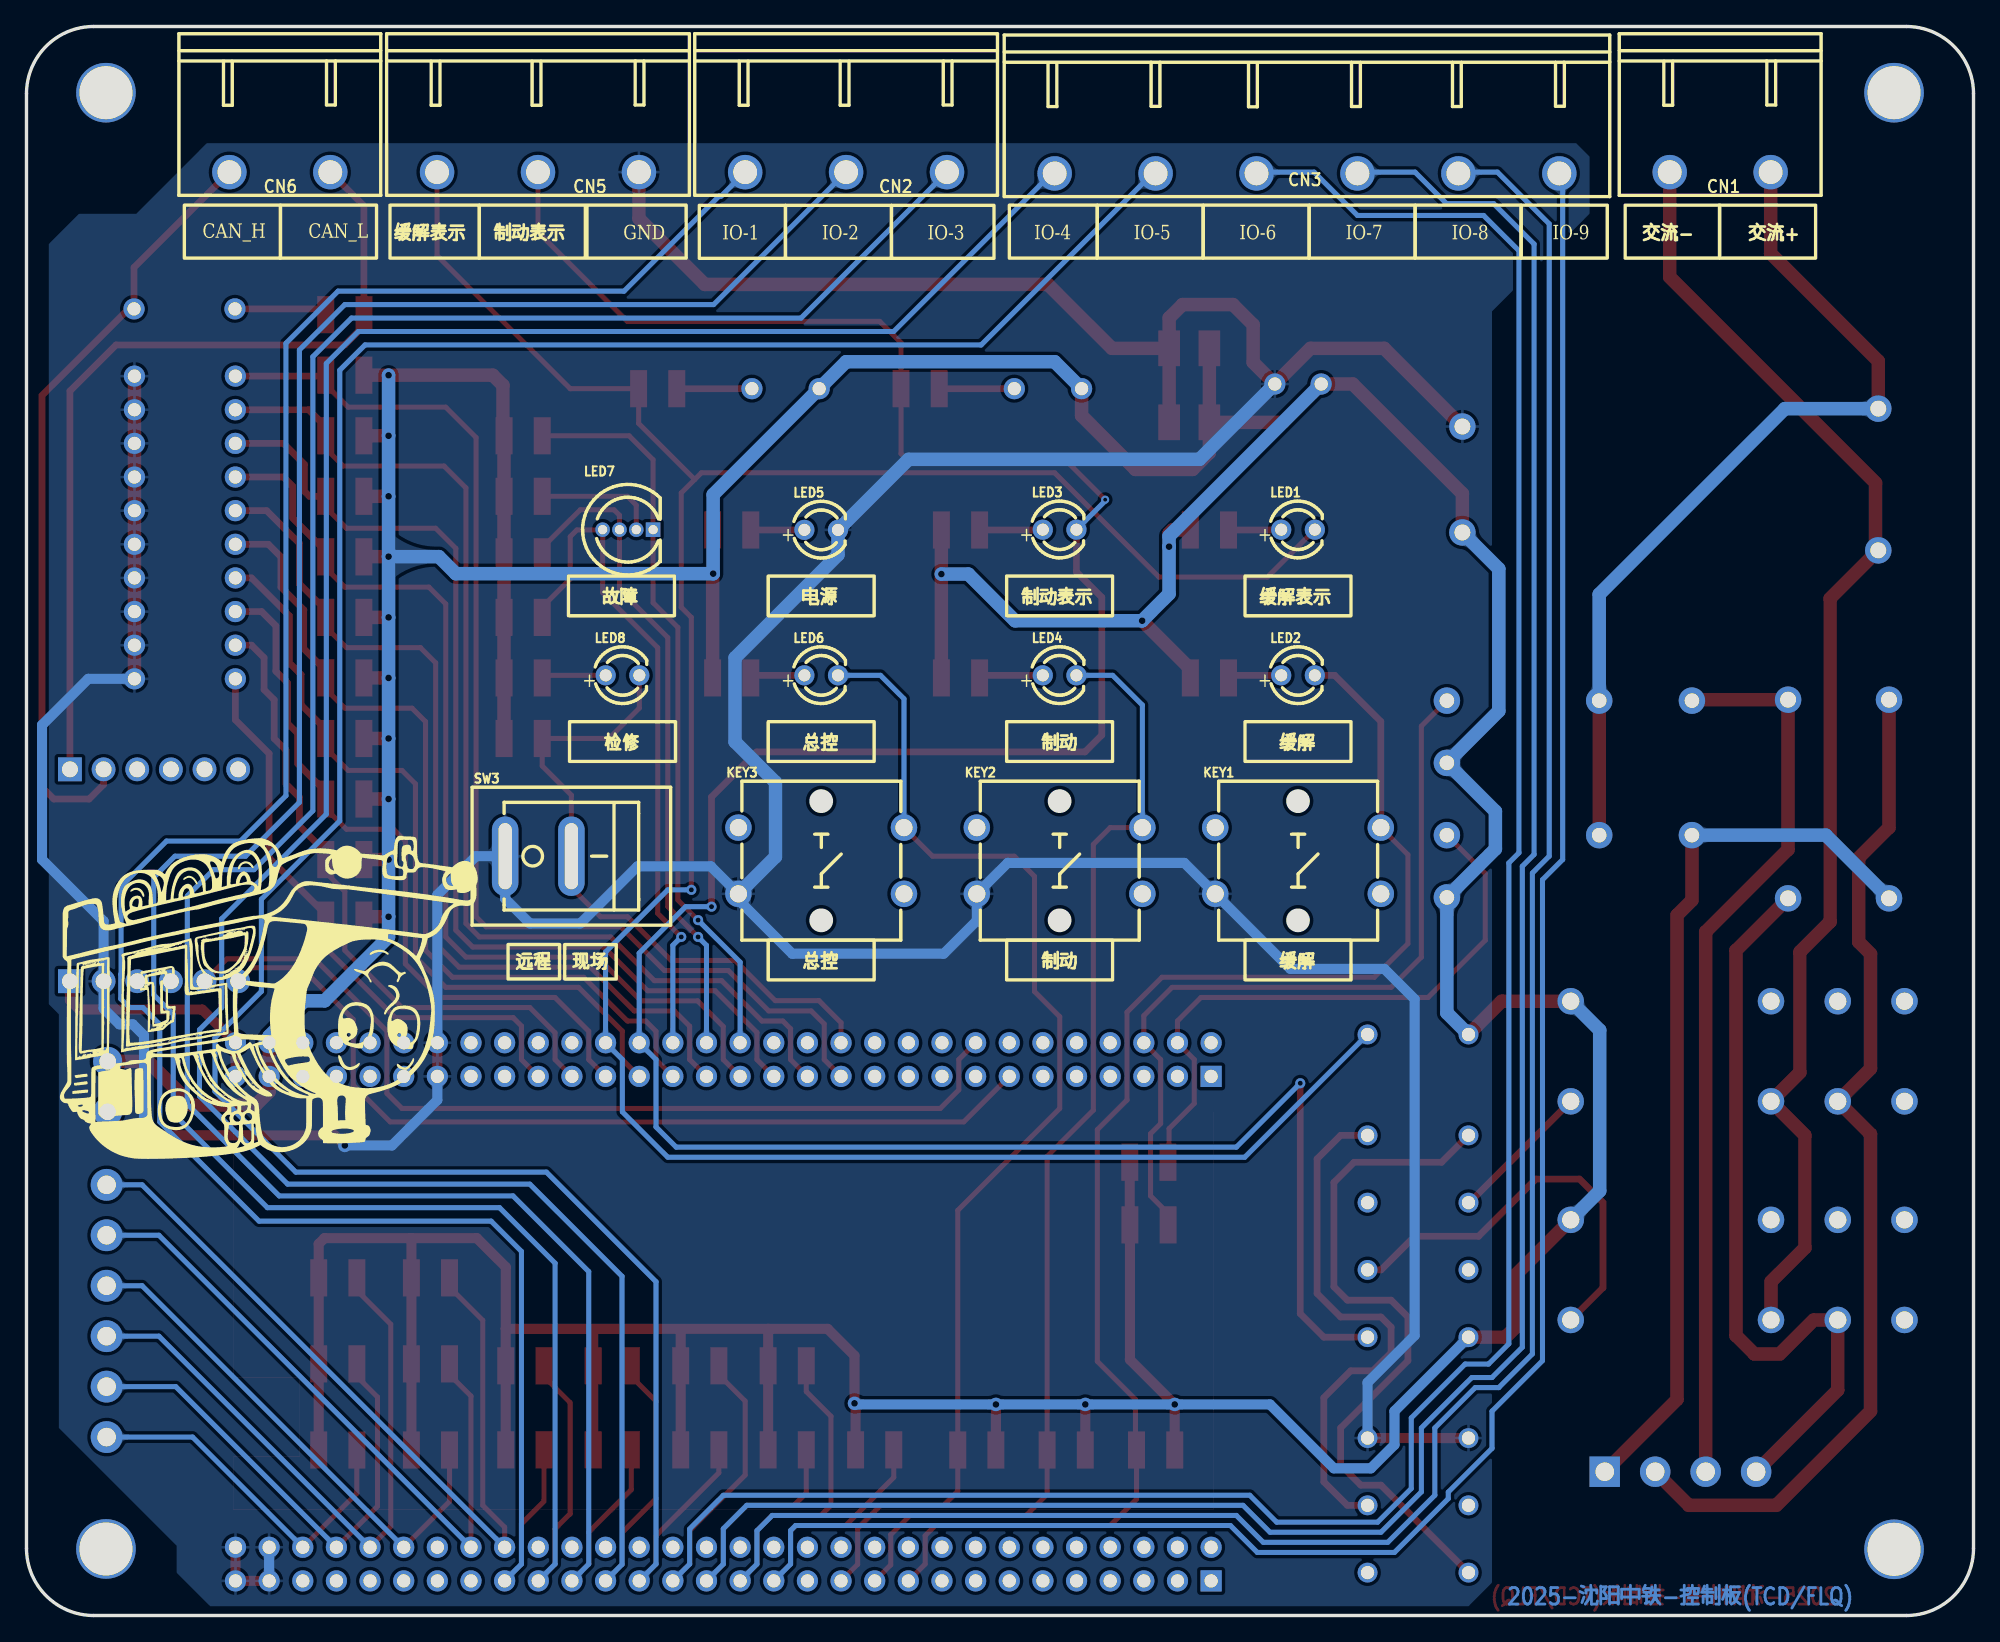
[diagram p3: board, bottom side, seen from below]

Outline 147 x 120 mm; copper layers: Top Layer, Bottom Layer. Coordinates in mm from the lower left corner of the outline.
Outline path: 0,114.92 0,5.08 arc(1.49,1.49) 5.08,0 141.92,0 arc(145.51,1.49) 147,5.08 147,114.92 arc(145.51,118.51) 141.92,120 5.08,120 arc(1.49,118.51) 0,114.92
Stack: Top Layer 0.035mm / Dielectric1 1.51mm FR4 er 4.5 / Bottom Layer 0.035mm

## Design rules (mm)
template: 自定义配置
spacing copperThickness1oz (default): track to track 0.102, other pairs 0.152 to 0.3
spacing copperThickness2oz: track to track 0.203, other pairs 0.152 to 0.3
track width copperThickness1oz (default): min 0.127, default 0.254, max 2.54
track width copperThickness2oz: min 0.203, default 0.254, max 2.54
track width trackWidth1: min 0.508, default 1.016, max 2.54
differential pair differentialPair (default): width min 0.127, default 0.254, max 2.54; gap min 0.152, default 0.152
via viaSize (default): diameter min 0.5, default 0.61, max 10; hole min 0.3, default 0.305, max 6.3
net +5V uses copperThickness2oz
net GND uses copperThickness2oz
net +AC uses copperThickness2oz, trackWidth1
net -AC uses copperThickness2oz, trackWidth1
net +RELIEF uses copperThickness2oz, trackWidth1
net -RELIEF uses copperThickness2oz, trackWidth1
net +BRAKE uses copperThickness2oz, trackWidth1
net -BRAKE uses copperThickness2oz, trackWidth1
net +RELEASE uses copperThickness2oz, trackWidth1
net -RELEASE uses copperThickness2oz, trackWidth1
net +3V3 uses copperThickness2oz

## Placement (name value [footprint] x y rotation side)
C1  47nF  [CAP-TH_L18.0-W5.0-P15.00-D0.8]  6.38 61.66 90 top
C2  47nF  [CAP-TH_L18.0-W5.0-P15.00-D0.8]  14 61.66 270 top
C3  470uF  [CAP-TH_BD8.0-P3.50-D0.6-FD]  51 93 0 top
C4  100nF  [C1210]  59.21 95.7 0 top
C5  100nF  [C1210]  59.21 90.11 0 top
C6  2200uF  [CAP-TH_BD10.0-P5.00-D1.0-FD]  69.88 92.65 0 top
C7  2200uF  [CAP-TH_BD10.0-P5.00-D1.0-FD]  89.69 92.65 0 top
CN1  KF2EDGRC-7.62-2P  [CONN-TH_P7.62_KF2EDGRC-7.62-2P]  19.13 109 0 bottom
CN2  KF2EDGRC-7.62-3P  [CONN-TH_3P-P7.62_KF2EDGRC-7.62-3P]  85.12 109 0 bottom
CN3  KF2EDGRC-7.62-6P  [CONN-TH_6P-P7.62_KF2EDGRC-7.62-6P]  50.32 108.9 0 bottom
CN5  KF2EDGRC-7.62-3P  [CONN-TH_3P-P7.62_KF2EDGRC-7.62-3P]  108.38 109 0 bottom
CN6  KF2EDGRC-7.62-2P  [CONN-TH_P7.62_KF2EDGRC-7.62-2P]  127.87 109 0 bottom
CN7  WJ15EDGVC-3.81-4P  [CONN-TH_4P-P3.81_WJ2EDGVC-3.81-4P]  22.13 10.86 180 top
CN8  WJ15EDGVC-3.81-2P  [CONN-TH_WJ15EDGVC-3.81-2P]  140.87 39.94 270 top
CN9  DB2EVC-3.81-6P-GN  [CONN-TH_6P-P3.81_DB2EVC-3.81-6P]  140.95 23 270 top
H1  2.54-1x6P直针  [HDR-TH_6P-P2.54-V-M-1]  137.37 63.9 180 top
H2  2.54-1x6P直针  [HDR-TH_6P-P2.54-V-M-1]  137.37 47.9 180 top
K1  HRS2H-S-DC5V-N  [RELAY-TH_HRS2H-S-XX]  41.94 12.13 270 top
K2  HRS2H-S-DC5V-N  [RELAY-TH_HRS2H-S-XX]  41.94 34.99 270 top
KEY1  B3F-4055  [KEY-TH_4P-L12.0-W12.0-P5.00-LS13.4-EH]  51 57 180 bottom
KEY2  B3F-4055  [KEY-TH_4P-L12.0-W12.0-P5.00-LS13.4-EH]  69 57 180 bottom
KEY3  B3F-4055  [KEY-TH_4P-L12.0-W12.0-P5.00-LS13.4-EH]  87 57 180 bottom
LED1  204-10SURD/S530-A3  [LED-TH_BD3.0-P2.54-FD]  51 82 180 bottom
LED2  204-10SURD/S530-A3  [LED-TH_BD3.0-P2.54-FD]  51 71 180 bottom
LED3  204-10SURD/S530-A3  [LED-TH_BD3.0-P2.54-FD]  69 82 180 bottom
LED4  204-10SURD/S530-A3  [LED-TH_BD3.0-P2.54-FD]  69 71 180 bottom
LED5  204-10SURD/S530-A3  [LED-TH_BD3.0-P2.54-FD]  87 81.98 180 bottom
LED6  204-10SURD/S530-A3  [LED-TH_BD3.0-P2.54-FD]  87 71 180 bottom
LED7  MHLA5319URGBDWT  [LED-TH_4P-BD6.9-P1.27-R]  101.6 82 180 bottom
LED8  204-10SURD/S530-A3  [LED-TH_BD3.0-P2.54-FD]  102 71 180 bottom
NOREF  -  [M4螺丝]  6 115 0 top
R1  10kΩ  [R1210]  62.25 29.5 0 top
R2  10kΩ  [R1210]  62.26 34.23 0 top
R3  360Ω  [R1210]  75.25 12.5 180 top
R4  360Ω  [R1210]  68.5 12.5 180 top
R5  360Ω  [R1210]  61.75 12.5 180 top
R6  360Ω  [R1210]  109.5 89.09 180 top
R7  360Ω  [R1210]  109.5 79.95 180 top
R8  360Ω  [R1210]  109.5 75.38 180 top
R9  10kΩ  [R1210]  109.38 12.51 0 top
R10  10kΩ  [R1210]  109.38 18.86 0 top
R11  10kΩ  [R1210]  102.77 12.51 0 top
R12  10kΩ  [R1210]  102.77 18.86 0 top
R13  10kΩ  [R1210]  96.17 12.51 0 top
R14  10kΩ  [R1210]  96.17 18.86 0 top
R15  10kΩ  [R1210]  89.56 12.51 0 top
R16  10kΩ  [R1210]  89.56 18.86 0 top
R17  10kΩ  [R1210]  82.96 12.51 0 top
R18  120Ω  [R1210]  122.97 98.24 180 top
R19  10kΩ  [R1210]  109.5 66.23 180 top
R21  1kΩ  [R1210]  57.69 70.8 180 top
R22  1kΩ  [R1210]  76.48 70.8 180 top
R23  1kΩ  [R1210]  93.76 70.8 180 top
R24  1kΩ  [R1210]  93.76 81.98 180 top
R25  1kΩ  [R1210]  76.48 81.98 180 top
R26  1kΩ  [R1210]  57.69 81.98 180 top
R27  1kΩ  [R1210]  109.5 70.8 180 top
R28  1kΩ  [R1210]  109.5 84.52 180 top
R31  360Ω  [R1210]  122.97 93.66 0 top
R32  360Ω  [R1210]  122.97 89.09 0 top
R33  360Ω  [R1210]  122.97 84.52 0 top
R34  360Ω  [R1210]  122.97 79.95 0 top
R35  360Ω  [R1210]  122.97 75.38 0 top
R36  360Ω  [R1210]  122.97 70.8 180 top
R37  360Ω  [R1210]  122.97 66.23 180 top
R38  360Ω  [R1210]  122.97 61.66 180 top
R39  360Ω  [R1210]  122.97 57.09 180 top
R40  360Ω  [R1210]  122.97 52.52 180 top
R41  360Ω  [R1210]  79.53 92.65 180 top
R42  360Ω  [R1210]  99.34 92.65 180 top
R43  10kΩ  [R1210]  116.5 25.5 0 top
R44  10kΩ  [R1210]  116.5 19 0 top
R45  10kΩ  [R1210]  116.5 12.5 0 top
R46  10kΩ  [R1210]  123.5 25.5 0 top
R47  10kΩ  [R1210]  123.5 19 0 top
R48  10kΩ  [R1210]  123.5 12.5 0 top
RELAY1  HF115F/005-2ZS4  [RELAY-TH_HF115F-024-2ZS4]  17.81 42.61 270 top
RELAY2  HF115F/005-2ZS4  [RELAY-TH_HF115F-024-2ZS4]  17.81 26.1 270 top
RLY1  HF46F/5-HS1T  [RELAYS-TH_HF46F-XX-HS1-XXX]  30.51 56.58 180 top
RLY2  HF46F/5-HS1T  [RELAYS-TH_HF46F-XX-HS1-XXX]  30.51 66.74 180 top
SCREW2  -  [M4螺丝]  6 5 0 top
SCREW3  -  [M4螺丝]  141 115 0 top
SCREW4  -  [M4螺丝]  141 5.03 0 top
SW1  DS-10RP  [SW-TH_DS-10RP]  135.04 82.17 90 top
SW2  DSWB01LHGET  [SW-TH_DSWB01LHGET]  135.07 98.67 90 top
SW3  RS601HL-1010011BB  [SW-TH_RS601HL-1010011BB]  108.36 57.34 180 bottom
U1  TAS10-5-W2  [PWRM-TH_TAS10-XX-W2]  22.89 85.79 0 top
U2  ZX-PM2.54-2-30PY  [HDR-TH_60P-P2.54-V-F-R2-C30-S2.54]  94.39 41.98 0 top
U3  ZX-PM2.54-2-30PY  [HDR-TH_60P-P2.54-V-F-R2-C30-S2.54]  94.39 3.88 0 top

## Footprints (pads in the part's own frame, mm; a bottom-side part is the same pattern mirrored in y, then rotated)
C1210
  rect 1.635x2.7 smd: 1(-1.518,0) 2(1.518,0)
CAP-TH_BD8.0-P3.50-D0.6-FD
  round 1.6 hole 1: 1(-1.75,0) 2(1.75,0)
CAP-TH_BD10.0-P5.00-D1.0-FD
  round 1.6 hole 1: 1(-2.54,0) 2(2.54,0)
CAP-TH_L18.0-W5.0-P15.00-D0.8
  round 2 hole 1.2: 1(-7.5,0) 2(7.5,0)
CONN-TH_3P-P7.62_KF2EDGRC-7.62-3P
  round 2.6 hole 1.8: 1(-7.62,0) 2(0,0) 3(7.62,0)
CONN-TH_4P-P3.81_WJ2EDGVC-3.81-4P
  rect 2.3x2.3 hole 1.4: 1(-5.715,0)
  round 2.3 hole 1.4: 2(-1.905,0) 3(1.905,0) 4(5.715,0)
CONN-TH_6P-P3.81_DB2EVC-3.81-6P
  round 2.4 hole 1.4: 1(-9.525,0) 2(-5.715,0) 3(-1.905,0) 4(1.905,0) 5(5.715,0) 6(9.525,0)
CONN-TH_6P-P7.62_KF2EDGRC-7.62-6P
  round 2.6 hole 1.8: 1(-19.05,0) 2(-11.43,0) 3(-3.81,0) 4(3.81,0) 5(11.43,0) 6(19.05,0)
CONN-TH_P7.62_KF2EDGRC-7.62-2P
  round 2.6 hole 1.8: 1(-3.81,0) 2(3.81,0)
CONN-TH_WJ15EDGVC-3.81-2P
  round 2.2 hole 1.25: 1(-1.905,0) 2(1.905,0)
HDR-TH_6P-P2.54-V-M-1
  rect 1.8x1.8 hole 1.2: 1(-6.35,0)
  round 1.8 hole 1.2: 2(-3.81,0) 3(-1.27,0) 4(1.27,0) 5(3.81,0) 6(6.35,0)
HDR-TH_60P-P2.54-V-F-R2-C30-S2.54
  rect 1.6x1.6 hole 1: 1(-36.83,-1.27)
  round 1.6 hole 1: 2(-36.83,1.27) 3(-34.29,-1.27) 4(-34.29,1.27) 5(-31.75,-1.27) 6(-31.75,1.27) 7(-29.21,-1.27) 8(-29.21,1.27) 9(-26.67,-1.27) 10(-26.67,1.27) 11(-24.13,-1.27) 12(-24.13,1.27) 13(-21.59,-1.27) 14(-21.59,1.27) 15(-19.05,-1.27) 16(-19.05,1.27) 17(-16.51,-1.27) 18(-16.51,1.27) 19(-13.97,-1.27) 20(-13.97,1.27) 21(-11.43,-1.27) 22(-11.43,1.27) 23(-8.89,-1.27) 24(-8.89,1.27) 25(-6.35,-1.27) 26(-6.35,1.27) 27(-3.81,-1.27) 28(-3.81,1.27) 29(-1.27,-1.27) 30(-1.27,1.27) 31(1.27,-1.27) 32(1.27,1.27) 33(3.81,-1.27) 34(3.81,1.27) 35(6.35,-1.27) 36(6.35,1.27) 37(8.89,-1.27) 38(8.89,1.27) 39(11.43,-1.27) 40(11.43,1.27) 41(13.97,-1.27) 42(13.97,1.27) 43(16.51,-1.27) 44(16.51,1.27) 45(19.05,-1.27) 46(19.05,1.27) 47(21.59,-1.27) 48(21.59,1.27) 49(24.13,-1.27) 50(24.13,1.27) 51(26.67,-1.27) 52(26.67,1.27) 53(29.21,-1.27) 54(29.21,1.27) 55(31.75,-1.27) 56(31.75,1.27) 57(34.29,-1.27) 58(34.29,1.27) 59(36.83,-1.27) 60(36.83,1.27)
KEY-TH_4P-L12.0-W12.0-P5.00-LS13.4-EH
  round 2 hole 1.3: 1(6.25,-2.5) 2(-6.25,-2.5) 3(6.25,2.5) 4(-6.25,2.5)
LED-TH_4P-BD6.9-P1.27-R
  rect 1.1x1.1 hole 0.7: 1(1.905,0)
  round 1.1 hole 0.7: 2(0.635,0) 3(-0.635,0) 4(-1.905,0)
LED-TH_BD3.0-P2.54-FD
  round 1.524 hole 0.914: 1(-1.27,0) 2(1.27,0)
M4螺丝
  round 4.5 hole 4: 1(0,0)
PWRM-TH_TAS10-XX-W2
  round 2 hole 1.2: 1(-15.7,-5.35) 2(-15.7,5.35) 4(15.7,4) 6(15.7,-4)
R1210
  rect 1.282x2.808 smd: 1(-1.441,0) 2(1.441,0)
RELAY-TH_HF115F-024-2ZS4
  round 2 hole 1.3: 1(-3.78,12.6) 2(3.78,12.6) 3(-3.78,-2.52) 4(3.78,-2.52) 5(-3.78,-7.56) 6(3.78,-7.56) 7(-3.78,-12.6) 8(3.78,-12.6)
RELAY-TH_HRS2H-S-XX
  round 1.5 hole 1: 1(-8.89,-3.81) 2(-8.89,3.81) 3(-1.27,-3.81) 4(3.81,-3.81) 5(8.89,-3.81) 6(8.89,3.81) 7(3.81,3.81) 8(-1.27,3.81)
RELAYS-TH_HF46F-XX-HS1-XXX
  round 2 hole 1.1: 1(-9.25,-2.35) 2(2.25,-2.35) 3(9.25,-2.35) 6(-9.25,2.35)
SW-TH_DS-10RP
  round 1.6 hole 1: 1(-11.43,-3.81) 2(-8.89,-3.81) 3(-6.35,-3.81) 4(-3.81,-3.81) 5(-1.27,-3.81) 6(1.27,-3.81) 7(3.81,-3.81) 8(6.35,-3.81) 9(8.89,-3.81) 10(11.43,-3.81) 11(11.43,3.81) 12(8.89,3.81) 13(6.35,3.81) 14(3.81,3.81) 15(1.27,3.81) 16(-1.27,3.81) 17(-3.81,3.81) 18(-6.35,3.81) 19(-8.89,3.81) 20(-11.43,3.81)
SW-TH_DSWB01LHGET
  round 1.6 hole 1: 1(0,3.81) 2(0,-3.81)
SW-TH_RS601HL-1010011BB
  oval 2x6 hole 1x5: 1(-2.5,0) 2(2.5,0)

## Nets
As in the schematic.

Pads without a net: H1 3 4 5 6; H2 3 4; K1 4 6; K2 5 7; KEY1 1 4; KEY2 1 4; KEY3 1 4; NOREF 1; RELAY1 3 5 7 8; RELAY2 3 5 7 8; SCREW2 1; SCREW3 1; SCREW4 1; U2 1 2 3 5 7 8 9 10 11 12 14 15 17 18 19 20 21 22 26 28 40 42 43 44 45 46 49 50 51 52 53 54 55 56; U3 1 2 3 4 5 6 7 8 9 10 11 12 13 14 15 16 17 18 20 22 24 25 26 28 30 32 34 36 38 40 42 45 47 48 49 51 53 55

## Via types
v1: diameter 1.016, hole 0.508, Top Layer to Bottom Layer, 20 vias
v2: diameter 0.762, hole 0.381, Top Layer to Bottom Layer, 6 vias
v3: diameter 0.61, hole 0.305, Top Layer to Bottom Layer, 1 via

## Routing (per net, layer and track width the routed paths; a pad name or vN(x,y) marks a point on that pad's centre or on a via; arc(x,y) is an arc through that point)
+3V3: length 17.8
  Top Layer w0.762: H2.1 143.72,46.47 143.01,45.76 133.73,45.76 U2.60 U2.59
+5V: length 601.8
  Top Layer w0.762: R48.2 R47.2 R46.2 124.94,28.06 124.5,28.5 118,28.5 ; 91.01,21.65 110.81,21.65 ; 91.01,21.65 R16.2 R15.2 ; 91.01,21.65 86.51,21.65 84.49,19.62 v1(84.49,16.02) 84.4,15.94 R17.2 ; 110.81,21.65 110.82,21.66 R10.2 R9.2 ; 110.81,21.65 110.81,26.31 113,28.5 118,28.5 ; 104.21,21.64 R12.2 R11.2 ; 97.61,21.63 R14.2 R13.2 ; R4.2 v1(67.06,15.94) ; 118,28.5 117.94,28.44 R43.2 R44.2 R45.2 ; R5.2 v1(60.31,15.94) 63.69,19.32 R1.2 63.7,29.51 R2.2 ; R3.2 v1(73.81,15.94)
  Top Layer w1.016: v1(119.66,61.66) R38.2 ; R24.1 R23.1 ; K2.1 35.62,46.39 RELAY1.1 ; RELAY2.1 34.57,25.72 34.57,21.78 35.34,21.02 K1.1 ; C5.1 52.14,90.11 C3.1 46.86,93 38.59,84.73 U1.6 ; C5.1 57.69,87.82 58.96,86.55 63.28,86.55 67.34,90.62 C6.1 ; C5.1 C4.1 ; R31.1 v1(119.66,93.66) 111.79,93.66 111.03,92.9 111.03,89.17 R6.1 R28.1 R7.1 R8.1 R27.1 R19.1 ; R21.1 59.13,71.48 v1(62.77,75.12) ; U2.58 U2.57 128.68,39.56 129.7,38.55 134.52,38.55 137.82,41.85 CN8.1 ; v1(119.66,66.23) R37.2 ; v1(119.66,57.09) R39.2 ; v1(119.66,79.96) 121.51,79.96 R34.1 ; R25.1 v1(77.93,78.65) R22.1 ; R40.2 121.27,52.77 v1(119.66,52.77) ; v1(119.66,89.09) R32.1 ; v1(119.66,84.52) R33.1 ; v1(119.66,70.8) R36.2 ; R26.1 60.48,81.98 60.74,81.73 v1(60.74,80.72) ; v1(119.66,75.38) R35.1
  Bottom Layer w0.762: K1.1 43.72,15.43 43.72,12.89 45.5,11.11 48.29,11.11 53.12,15.94 v1(60.31,15.94) v1(67.06,15.94) v1(73.81,15.94) 84.4,15.94 v1(84.49,16.02)
  Bottom Layer w1.016: RELAY2.1 28.22,32.07 28.22,44.2 RELAY1.1 ; C3.1 60.74,81.51 v1(60.74,80.72) 60.74,77.15 v1(62.77,75.12) 72.36,75.12 75.89,78.65 v1(77.93,78.65) ; v1(119.66,79.96) 115.87,79.96 114.58,78.68 v1(95.16,78.68) 95.16,84.64 C7.1 85.12,94.68 69.37,94.68 C6.1 ; v1(119.66,79.96) v1(119.66,84.52) v1(119.66,89.09) v1(119.66,93.66) ; v1(119.66,79.96) v1(119.66,75.38) v1(119.66,70.8) v1(119.66,66.23) v1(119.66,61.66) v1(119.66,57.09) v1(119.66,52.77) 119.66,51.25 124.49,46.42 126.01,46.42 128.68,43.75 U2.58 ; K2.1 39.76,45.51 RLY1.6 36.1,57.89 36.1,60.73 RLY2.6 35.84,68.31 35.84,79.04 U1.6
GND: length 407.2
  Top Layer w0.762: CN8.2 140.87,37.91 139.22,36.26 v1(138.13,36.26) 123.73,36.26 v1(122.97,35.5) ; K1.3 K1.8 ; U3.60 U3.59 U3.57 ; U2.48 U2.47
  Top Layer w1.016: C4.2 C5.2 ; C4.2 60.73,97.99 59.72,99 55.91,99 54.39,97.47 54.39,94.64 C3.2 50.05,95.7 44.5,95.7 U1.4 ; C4.2 65.05,95.7 69.88,100.52 95.79,100.52 100.76,105.5 CN5.1 ; SW1.1 SW1.2 SW1.3 SW1.4 SW1.5 SW1.6 SW1.7 SW1.8 SW1.9 SW1.10
  Bottom Layer w0.762: KEY3.2 95.33,56.58 100.87,56.58 105.19,52.26 109,52.26 110.86,54.13 SW3.1 113.06,57.34 115.98,54.42 U2.48 ; K1.8 45.75,17.59 42.19,21.15 42.19,46.55 44.48,48.83 51.58,48.83 KEY1.2 59.58,56.83 72.92,56.83 KEY2.2 75.25,52.48 77.75,49.98 89.18,49.98 93.48,54.27 ; v1(138.13,36.26) 138.13,43.81 138.97,44.64 139.98,44.64 141.18,45.84 H2.2 141.18,52.44 145.83,57.09 145.83,67.25 142.34,70.74 SW1.1 ; U2.47 115.98,38.93 119.41,35.5 v1(122.97,35.5) ; U3.58 U3.57
  Bottom Layer w1.016: KEY3.2 90.45,57.3 90.45,62.93 93.5,65.98 93.5,72.33 85.73,80.1 LED5.2 80.4,87.31 58.44,87.31 C3.2
+AC: length 66.3
  Top Layer w1.016: CN1.1 15.32,102.85 7.19,94.73 U1.2 ; RLY1.2 RLY2.2
  Bottom Layer w1.016: U1.2 14.24,91.14 28.26,77.12 RLY2.2
+BRAKE: length 67.7
  Top Layer w1.016: CN7.1 22.38,16.32 22.38,52.9 21.26,54.02 RLY1.3
  Bottom Layer w1.016: C1.1 11.15,58.93 RLY1.3
+RELEASE: length 68.2
  Top Layer w1.016: RLY2.3 21.19,69.16 C2.1 14,57.85 20.22,51.63 CN7.3
-AC: length 98.7
  Top Layer w1.016: RELAY2.4 15.29,25.2 12.73,27.76 12.73,36.27 RELAY1.4 13.11,41.01 13.11,50.1 10.83,52.39 10.83,76.81 U1.1 7.4,80.65 7.4,85.54 22.94,101.08 CN1.2
-BRAKE: length 77.3
  Top Layer w1.016: C1.2 6.38,59.5 8.67,57.22 8.67,50.86 7.78,49.98 7.78,41.3 RELAY1.6 7.78,36.36 7.78,15.43 14.89,8.32 21.49,8.32 CN7.2
-RELEASE: length 58
  Top Layer w1.016: CN7.4 10.25,17.02 RELAY2.6 12.06,22.32 14.64,19.75 16.54,19.75 17.94,21.15 17.94,50.22 C2.2
BRAKE_BTN: length 87
  Top Layer w0.381: U3.21 81.75,3.82 81.75,6.1 80.29,7.56 71.53,7.56 69.94,9.15 R4.1 69.94,34.68 66.45,38.17 66.45,58.23 65.18,59.5 KEY2.3
  Bottom Layer w0.381: KEY2.3 62.75,68.75 65,71 LED4.2
BRAKE_DISABLE: length 10.9
  Top Layer w0.508: RELAY1.2 38.06,31.18 K2.4
BRAKE_EN: length 46.9
  Top Layer w0.381: R2.1 60.74,34.31 60.74,36.77 58.83,38.67 58.83,41.98 U2.4 60.1,44.9 58.32,46.67 41.18,46.67 36.86,50.99 36.86,56.03 RLY1.1
BRAKE_STATUS: length 214.8
  Top Layer w0.381: v3(65.56,84.27) 68.61,87.31 80.55,87.31 80.97,87.74 R41.1 80.97,96.12 82.58,97.73 101.63,97.73 108.38,104.48 CN5.2
  Top Layer w0.508: v2(95.28,53.53) 95.28,61.82 91.88,65.22 67.09,65.22 65.82,66.49 65.82,76.9 67.73,78.81 LED3.2 ; v2(50.83,40.2) 50.83,22.8 49.05,21.02 K1.2
  Bottom Layer w0.381: LED3.2 65.56,84.17 v3(65.56,84.27) ; v2(95.28,53.53) 97.23,53.53 100.74,50.02 U2.36 99.47,41.98 99.47,36.9 97.95,35.37 55.66,35.37 v2(50.83,40.2)
CAN_H: length 59.2
  Top Layer w0.508: H1.2 141.18,62.75 142.27,61.66 144.94,61.66 145.83,62.55 145.83,92.14 139.29,98.67 SW2.2 138.88,101.8 CN6.2
CAN_L: length 65.5
  Top Layer w0.508: CN6.1 121.53,106.46 R18.2 121.53,97.39 122.97,95.95 140.24,95.95 143.72,92.47 H1.1
CTRL_BTN: length 90.4
  Top Layer w0.381: U3.23 84.25,3.86 84.25,6.58 82.51,8.32 77.75,8.32 76.69,9.38 R3.1 76.69,30.59 68.99,38.29 68.99,45.22 70.9,47.12 70.9,55.82 72.42,57.34 78.59,57.34 KEY3.3
  Bottom Layer w0.381: LED6.2 82.52,71 80.75,69.23 KEY3.3
DEVICE_ID0: length 90.9
  Top Layer w0.381: U2.23 86.77,41.98 86.77,44.67 87.75,45.66 90.96,45.66 94.01,48.71 98.84,48.71 102.14,52.01 112.3,52.01 113.06,52.77 113.06,88.97 115.35,91.25 122.71,91.25 124.41,92.95 R31.2
  Top Layer w0.508: R31.2 124.47,93.6 SW1.11
DEVICE_ID1: length 85.6
  Top Layer w0.381: U2.25 89.31,41.98 89.31,44.31 89.89,44.9 91.47,44.9 94.52,47.94 99.6,47.94 102.9,51.25 112.81,51.25 113.82,52.26 113.82,85.16 115.47,86.81 123.09,86.81 124.41,88.12 R32.2
  Top Layer w0.508: SW1.12 125.69,91.06 124.41,89.77 R32.2
FUNC_SEL: length 44.7
  Top Layer w0.381: U2.41 109.63,41.98 109.63,44.52 110.26,45.15 119.16,45.15 124.41,50.4 R40.1
  Top Layer w0.508: SW1.20 131.23,67.64 128.68,65.09 128.68,57.22 124.41,52.94 R40.1
IO1: length 177
  Top Layer w0.381: R9.1 107.94,8.62 109.63,6.92 109.63,3.88 U3.43
  Bottom Layer w0.381: CN2.3 94.56,107.19 94.71,107.19 101.88,100.01 123.47,100.01 127.41,96.08 127.41,61.91 130.84,58.48 136.43,58.48 139.86,55.06 139.86,48.44 139.88,48.42 139.88,46.57 139.22,45.91 138.21,45.91 136.94,44.64 136.94,37.28 129.44,29.78 111.92,29.78 109.63,27.5 109.63,3.88 U3.43
IO2: length 188.9
  Top Layer w0.381: R10.1 107.94,18.06 105.95,16.07 105.95,7.69 107.09,6.54 107.09,3.88 U3.41
  Bottom Layer w0.381: CN2.2 95.12,99 122.97,99 126.4,95.57 126.4,61.41 130.46,57.34 135.79,57.34 137.39,55.74 137.39,46.88 135.92,45.4 135.92,37.91 128.81,30.8 111.28,30.8 107.09,26.61 107.09,3.88 U3.41
IO3: length 187
  Top Layer w0.381: U3.39 104.55,3.88 104.55,6.29 101.33,9.51 R11.1
  Bottom Layer w0.381: U3.39 104.55,3.88 104.55,25.97 110.27,31.69 127.92,31.69 134.86,38.63 134.86,54.34 132.87,56.33 129.82,56.33 125.38,60.77 125.38,95.06 122.46,97.98 88.52,97.98 CN2.1
IO4: length 199.8
  Top Layer w0.381: U3.37 102.01,3.88 102.01,6.29 99.47,8.83 99.47,16.19 101.33,18.06 R12.1
  Bottom Layer w0.381: 69.49,109 81.53,96.97 121.95,96.97 124.36,94.55 124.36,60.52 132.26,52.62 132.26,45.91 133.94,44.24 133.94,39.23 127.28,32.58 109,32.58 102.04,25.62 102.04,3.86 U3.37
IO5: length 200.8
  Top Layer w0.381: U3.35 99.47,3.88 99.47,6.03 94.73,10.78 R13.1
  Bottom Layer w0.381: 61.87,109 74.92,95.95 121.44,95.95 123.35,94.05 123.35,60.01 129.26,54.09 129.26,47.13 132.77,43.63 132.77,39.59 126.67,33.48 107.74,33.48 99.47,25.21 99.47,3.88 U3.35
IO6: length 201.5
  Top Layer w0.381: U3.33 96.93,3.88 96.93,6.41 92.74,10.61 92.74,16.19 94.73,18.18 R14.1
  Bottom Layer w0.381: U3.33 96.93,3.88 96.93,6.54 94.39,9.08 54.64,9.08 52.61,7.05 44.99,7.05 42.45,9.59 42.45,14.92 38.38,18.99 36.61,18.99 35.08,20.52 35.08,56.83 34.32,57.6 34.32,103.06 36.99,105.73 46.51,105.73 49.78,109 54.25,109
IO7: length 189.1
  Top Layer w0.381: U3.31 94.39,3.88 94.39,6.54 92.61,8.32 89.06,8.32 88.12,9.25 R15.1
  Bottom Layer w0.381: U3.31 94.39,3.88 94.39,6.55 92.62,8.32 55.15,8.32 53.12,6.29 44.73,6.29 41.69,9.34 41.69,14.16 37.88,17.97 36.35,17.97 34.07,20.26 34.07,56.58 33.18,57.47 33.18,103.57 36.22,106.62 39.78,106.62 42.16,109 46.26,109
IO8: length 189.2
  Top Layer w0.381: R16.1 88.12,16.91 86.26,15.05 86.26,8.32 87.03,7.56 90.71,7.56 91.85,6.41 91.85,3.88 U3.29
  Bottom Layer w0.381: U3.29 91.85,3.88 91.85,6.4 90.7,7.56 55.66,7.56 53.62,5.53 44.23,5.53 40.67,9.08 40.67,14.16 37.62,17.21 35.84,17.21 33.3,19.75 33.3,56.07 32.03,57.34 32.03,105.09 35.94,109 38.64,109
IO9: length 176.3
  Top Layer w0.381: R17.1 81.52,10.43 85.16,6.8 88.93,6.8 89.31,6.41 89.31,3.88 U3.27
  Bottom Layer w0.381: 31.02,109 31.02,57.09 32.54,55.56 32.54,19.24 36.35,15.43 36.35,12.62 39.65,9.32 39.65,8.83 43.72,4.76 54.07,4.76 56.11,6.8 88.93,6.8 89.31,6.41 89.31,3.88 U3.27
IO11: length 63.5
  Top Layer w0.381: R43.1 115.06,24.8 112.55,22.29 112.55,8.32 110.9,6.67 U3.44
  Bottom Layer w0.381: CN9.1 138.27,32.53 U3.44
IO12: length 51.8
  Top Layer w0.381: R44.1 115.06,18.19 113.44,16.57 U3.46
  Bottom Layer w0.381: CN9.2 137,28.72 U3.46
IO13: length 39.9
  Top Layer w0.381: R45.1 115.06,8.62 U3.50
  Bottom Layer w0.381: 141.46,24.91 138.27,24.91 U3.50
IO14: length 49.1
  Top Layer w0.381: U3.52 119.5,6.71 119.5,22 122.06,24.56 R46.1
  Bottom Layer w0.381: U3.52 137,21.09 141.46,21.09
IO15: length 38.7
  Top Layer w0.381: U3.54 120.5,8.25 120.5,16.5 122.06,18.06 R47.1
  Bottom Layer w0.381: U3.54 135.73,17.28 141.46,17.28
IO16: length 27.8
  Top Layer w0.381: U3.56 122.06,9.24 R48.1
  Bottom Layer w0.381: U3.56 134.46,13.47 141.46,13.47
LED_B: length 51.1
  Top Layer w0.381: v2(97.57,51.25) 99.34,53.02 99.34,73.09 103.5,77.25 LED7.4 103.52,81.98 105.44,81.98 105.95,81.47 105.95,78.27 108.06,76.16 R8.2
  Bottom Layer w0.381: U2.34 98.2,50.61 v2(97.57,51.25)
LED_G: length 50.4
  Top Layer w0.381: R7.2 108.06,80.63 105.19,83.5 102.65,83.5 102.23,83.09 LED7.3 102.23,77.5 98.58,73.85 98.58,53.53 v2(96.3,51.25)
  Bottom Layer w0.381: v2(96.3,51.25) 95.66,50.61 U2.32
LED_R: length 55.9
  Top Layer w0.381: v2(96.3,52.52) 97.82,54.04 97.82,74.61 99.69,76.49 LED7.1 99.69,87.28 101.5,89.09 R6.2
  Bottom Layer w0.381: v2(96.3,52.52) 93.12,49.34 U2.30
PA7: length 49.5
  Top Layer w0.381: R39.1 124.41,56.12 122.97,54.67 122.97,50.23 118.65,45.91 109,45.91 107.09,44.01 107.09,41.98 U2.39
  Top Layer w0.508: R39.1 124.41,57.64 126.4,59.63 126.4,61.79 127.41,62.8 127.41,65.34 128.3,66.23 128.3,69.15 129.06,69.92 129.06,72.33 130.01,73.28 SW1.19
PB0: length 200.3
  Top Layer w0.381: 96.55,85.79 97.57,84.77 97.57,76.14 96.8,75.38 v2(96.8,54.8) ; 96.55,85.79 96.04,86.3 69.37,86.3 61.5,78.42 53.31,78.42 LED1.2 ; 96.55,85.79 100.78,90.03 R42.1 105.95,92.65 116,102.7 CN5.3
  Bottom Layer w0.381: v2(96.8,54.8) 98.58,54.8 103.28,50.1 U2.38 102.01,41.98 102.01,38.04 98.58,34.61 55.02,34.61 K2.2
PB1: length 59.2
  Top Layer w0.381: R37.1 124.41,65.51 122.71,63.82 118.65,63.82 117.63,62.8 117.63,49.72 115.35,47.44 105.32,47.44 102.01,44.13 102.01,41.98 U2.35
  Top Layer w0.508: R37.1 124.41,66.91 126.27,68.77 126.27,71.06 127.16,71.95 127.16,75.5 130.01,78.36 SW1.17
PB14: length 69.8
  Top Layer w0.381: U2.16 76.61,41.98 76.61,39.69 78.01,38.29 118.65,38.29 119.79,39.44 119.79,44.13 125.25,49.59 131.87,49.59 H2.5
PB15: length 67.8
  Top Layer w0.381: H2.6 130,48.92 126.22,48.92 122.33,45.02 122.33,40.07 119.54,37.28 76.24,37.28 U2.13
PC5: length 55.1
  Top Layer w0.381: R38.1 124.41,60.94 122.84,59.37 119.28,59.37 118.39,58.48 118.39,49.21 115.85,46.67 107.1,46.67 104.55,44.12 104.55,41.98 U2.37
  Top Layer w0.508: SW1.18 129.25,75.82 128.17,74.74 128.17,71.31 127.28,70.42 127.28,67.38 126.52,66.61 126.52,64.33 124.41,62.21 R38.1
PD2: length 107.4
  Top Layer w0.381: KEY1.3 42.7,57.45 42.7,50.74 45.24,48.2 61.28,48.2 63.91,45.56 63.91,38.93 66.15,36.69 66.15,19.19 63.28,16.32 63.28,12.59 R5.1 63.19,8.79 65.18,6.8 78.38,6.8 79.15,6.03 79.15,3.88 U3.19
  Top Layer w0.508: LED2.2 48.23,71 44.75,67.52 KEY1.3
PE10: length 49
  Top Layer w0.381: LED8.2 100.73,68.53 103.03,66.23 R19.2 108.06,64.16 105.86,61.95 SW3.2 105.86,54.97 103.66,52.77 101.63,52.77 98.33,49.47 93.5,49.47 90.47,46.44 87.17,46.44 85.5,44.77 U2.24
PF8: length 60.1
  Top Layer w0.381: RLY2.1 41.69,67.16 41.69,49.72 43.97,47.44 60.51,47.44 62.64,45.3 U2.6 61.37,41.98 61.37,37.15 62.13,36.39 62.13,31.69 60.81,30.36 R1.1
PF11: length 64.9
  Top Layer w0.381: R36.1 124.41,69.96 122.97,68.52 117.89,68.52 116.87,67.5 116.87,50.23 114.84,48.2 104.93,48.2 101.63,44.89 100.25,44.89 99.47,44.12 99.47,41.98 U2.33
  Top Layer w0.508: SW1.16 128.74,80.9 127.79,79.95 127.79,77.67 126.06,75.94 126.06,73.01 124.41,71.36 R36.1
PF13: length 69.7
  Top Layer w0.381: U2.31 96.93,41.98 96.93,44.5 98.09,45.66 101.12,45.66 104.42,48.96 114.33,48.96 116.11,50.74 116.11,71.95 117.25,73.09 122.84,73.09 124.41,74.66 R35.2
  Top Layer w0.508: SW1.15 128.87,83.44 126.4,80.96 126.4,77.92 124.41,75.93 R35.2
PF15: length 75.2
  Top Layer w0.381: U2.29 94.39,41.98 94.39,44.48 96.33,46.42 100.61,46.42 103.92,49.72 113.82,49.72 115.35,51.25 115.35,76.39 116.62,77.66 122.97,77.66 124.41,79.1 R34.2
  Top Layer w0.508: SW1.14 127.6,85.98 126.9,85.28 126.9,82.87 124.41,80.37 R34.2
PG1: length 80.2
  Top Layer w0.381: U2.27 91.85,41.98 91.85,44.03 95.01,47.18 100.11,47.18 103.41,50.48 113.31,50.48 114.58,51.75 114.58,80.58 116.11,82.11 122.84,82.11 124.41,83.67 R33.2
  Top Layer w0.508: SW1.13 127.6,88.52 126.01,86.93 126.01,84.9 125.63,84.52 R33.2
RELEASE_DISABLE: length 31.2
  Top Layer w0.508: RELAY2.2 27.97,24.76 27.97,31.18 29.75,32.96 33.05,32.96 37.37,28.64 42.19,28.64 44.73,26.1 K2.6
$1N6666: length 52.3
  Top Layer w0.508: K1.5 44.73,9.84 46.26,9.84 47.78,11.37 47.78,14.16 42.7,19.24 42.7,22.54 43.97,23.81 47.27,23.81 48.29,24.83 48.29,32.7 46.77,34.23 40.16,34.23 K2.3
$1N6674: length 40.2
  Top Layer w0.508: K1.7 47.27,8.32 49.05,10.1 49.05,16.45 47.02,18.48 45.34,18.48 43.97,19.85 43.97,21.78 44.73,22.54 47.78,22.54 49.56,24.32 49.56,34.48 47.78,36.26 K2.8
$1N37726: length 5.7
  Top Layer w0.508: R41.2 C6.2
$1N37765: length 5.7
  Top Layer w0.508: R42.2 C7.2
$1N49921: length 7
  Top Layer w0.508: R18.1 124.84,98.67 SW2.1
$2N2785: length 4.1
  Top Layer w0.508: LED2.1 56.05,71 R21.2
$2N2786: length 4.9
  Top Layer w0.508: LED4.1 74.85,71 R22.2
$2N2787: length 4.1
  Top Layer w0.508: LED6.1 92.12,71 R23.2
$2N2791: length 4.8
  Top Layer w0.508: LED3.1 70.29,81.98 R25.2
$2N2794: length 4
  Top Layer w0.508: R26.2 52.29,81.98 LED1.1
$2N2795: length 4
  Top Layer w0.508: R24.2 88.28,81.98 LED5.1
$2N4277: length 4.9
  Top Layer w0.381: R27.2 107.87,71 LED8.1
$2N10665: length 9.2
  Top Layer w0.381: LED7.2 100.96,83.85 101.63,84.52 R28.2

## Copper pours and planes (outline as drawn; the poured copper is in the pictures)
GND on Top Layer: 36.35,2.48 36.35,98.49 28.99,105.86 28.99,110.17 30,111.19 133.38,111.19 138.71,105.86 143.03,105.86 145.32,103.57 145.32,46.17 144.56,45.4 144.56,14.16 135.67,5.27 135.67,3.24 133.13,0.7 38.13,0.7
GND on Bottom Layer: 36.35,2.48 36.35,98.49 28.99,105.86 28.99,110.17 30,111.19 133.38,111.19 138.71,105.86 143.03,105.86 145.32,103.57 145.32,46.17 144.56,45.4 144.56,14.16 135.67,5.27 135.67,3.24 133.13,0.7 38.13,0.7

Small or netless copper shapes (teardrops, artwork), in the pictures only: 317 on Top Layer, 98 on Bottom Layer

## Text on the board
Bottom Layer: 2025-沈阳中铁-控制板(TCD/FLQ)
Bottom Silkscreen Layer: 交流+ | 交流- | IO-9 | IO-8 | IO-7 | 缓解 | + | 缓解表示 | IO-6 | IO-5 | 制动 | IO-4 | 制动表示 | IO-3 | IO-2 | 总控 | 电源 | IO-1 | GND | 检修 | 故障 | 现场 | 远程 | CAN_L | CAN_H
Top Layer: 2025-沈阳中铁-控制板(TCD/FLQ)
Top Silkscreen Layer: IO11 | IO12 | IO13 | IO14 | IO15 | IO16 | 制动 / + | 制动 / - | 缓解 / + | 缓解 / - | + | 防 / 溜 / 器 | 停 / 车 / 器 | 设备号 | 功能 | 股道号 | 120Ω | +5V | GND
